# EAGLE design RFModule900_Mark1 (EAGLE 7.2.0)
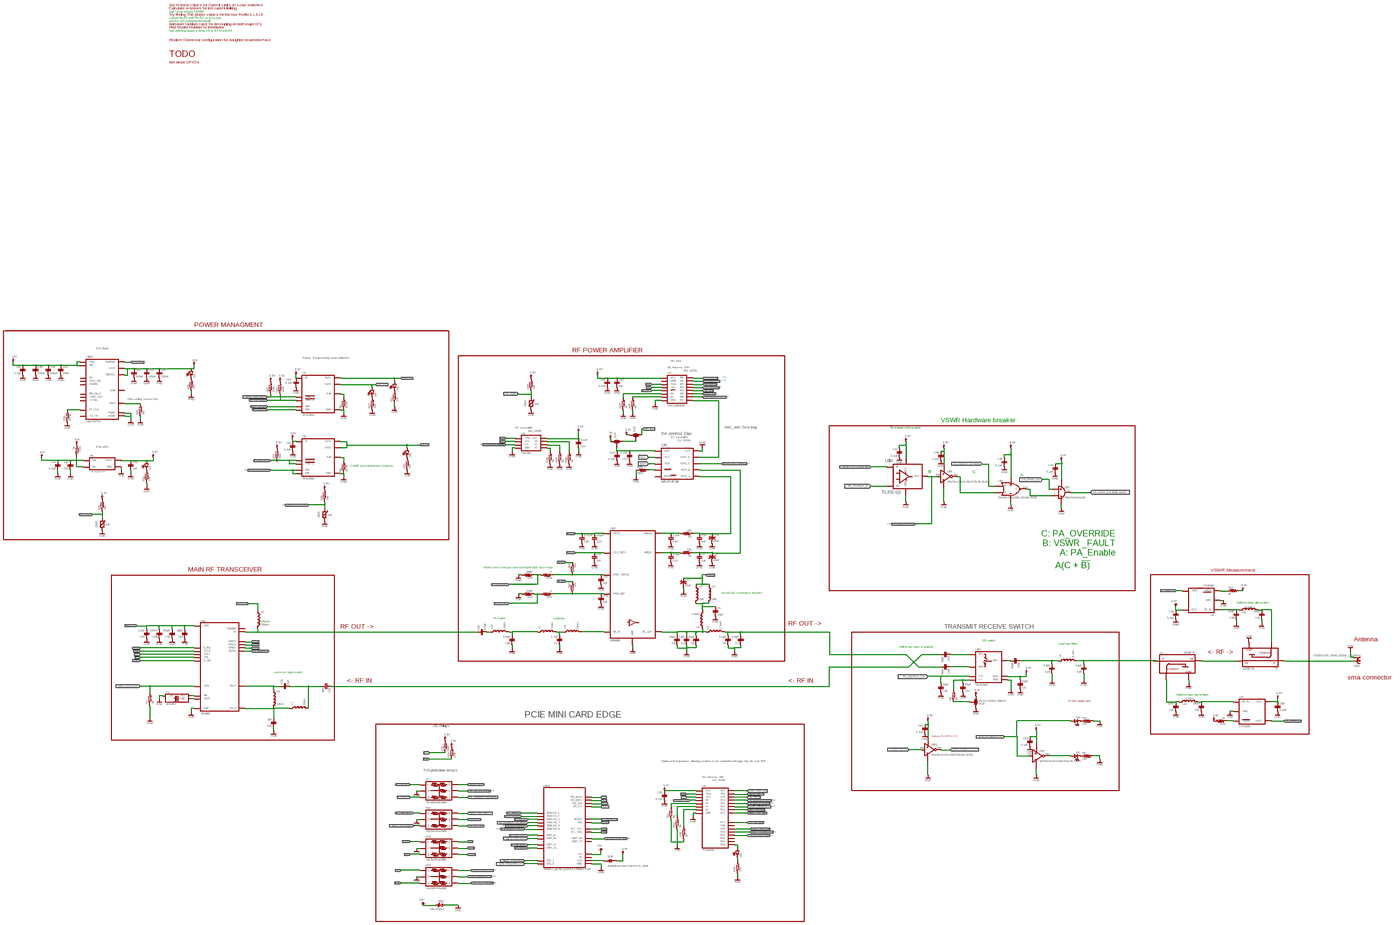
[diagram p0: schematic, sheet 1, overview]
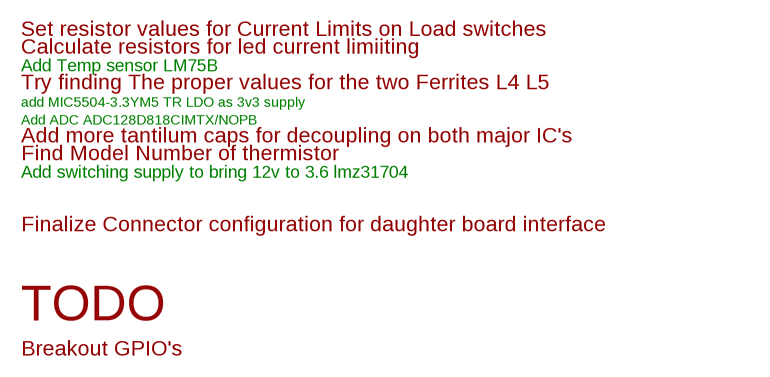
[diagram p1: schematic, sheet 1, part 1 of 4]
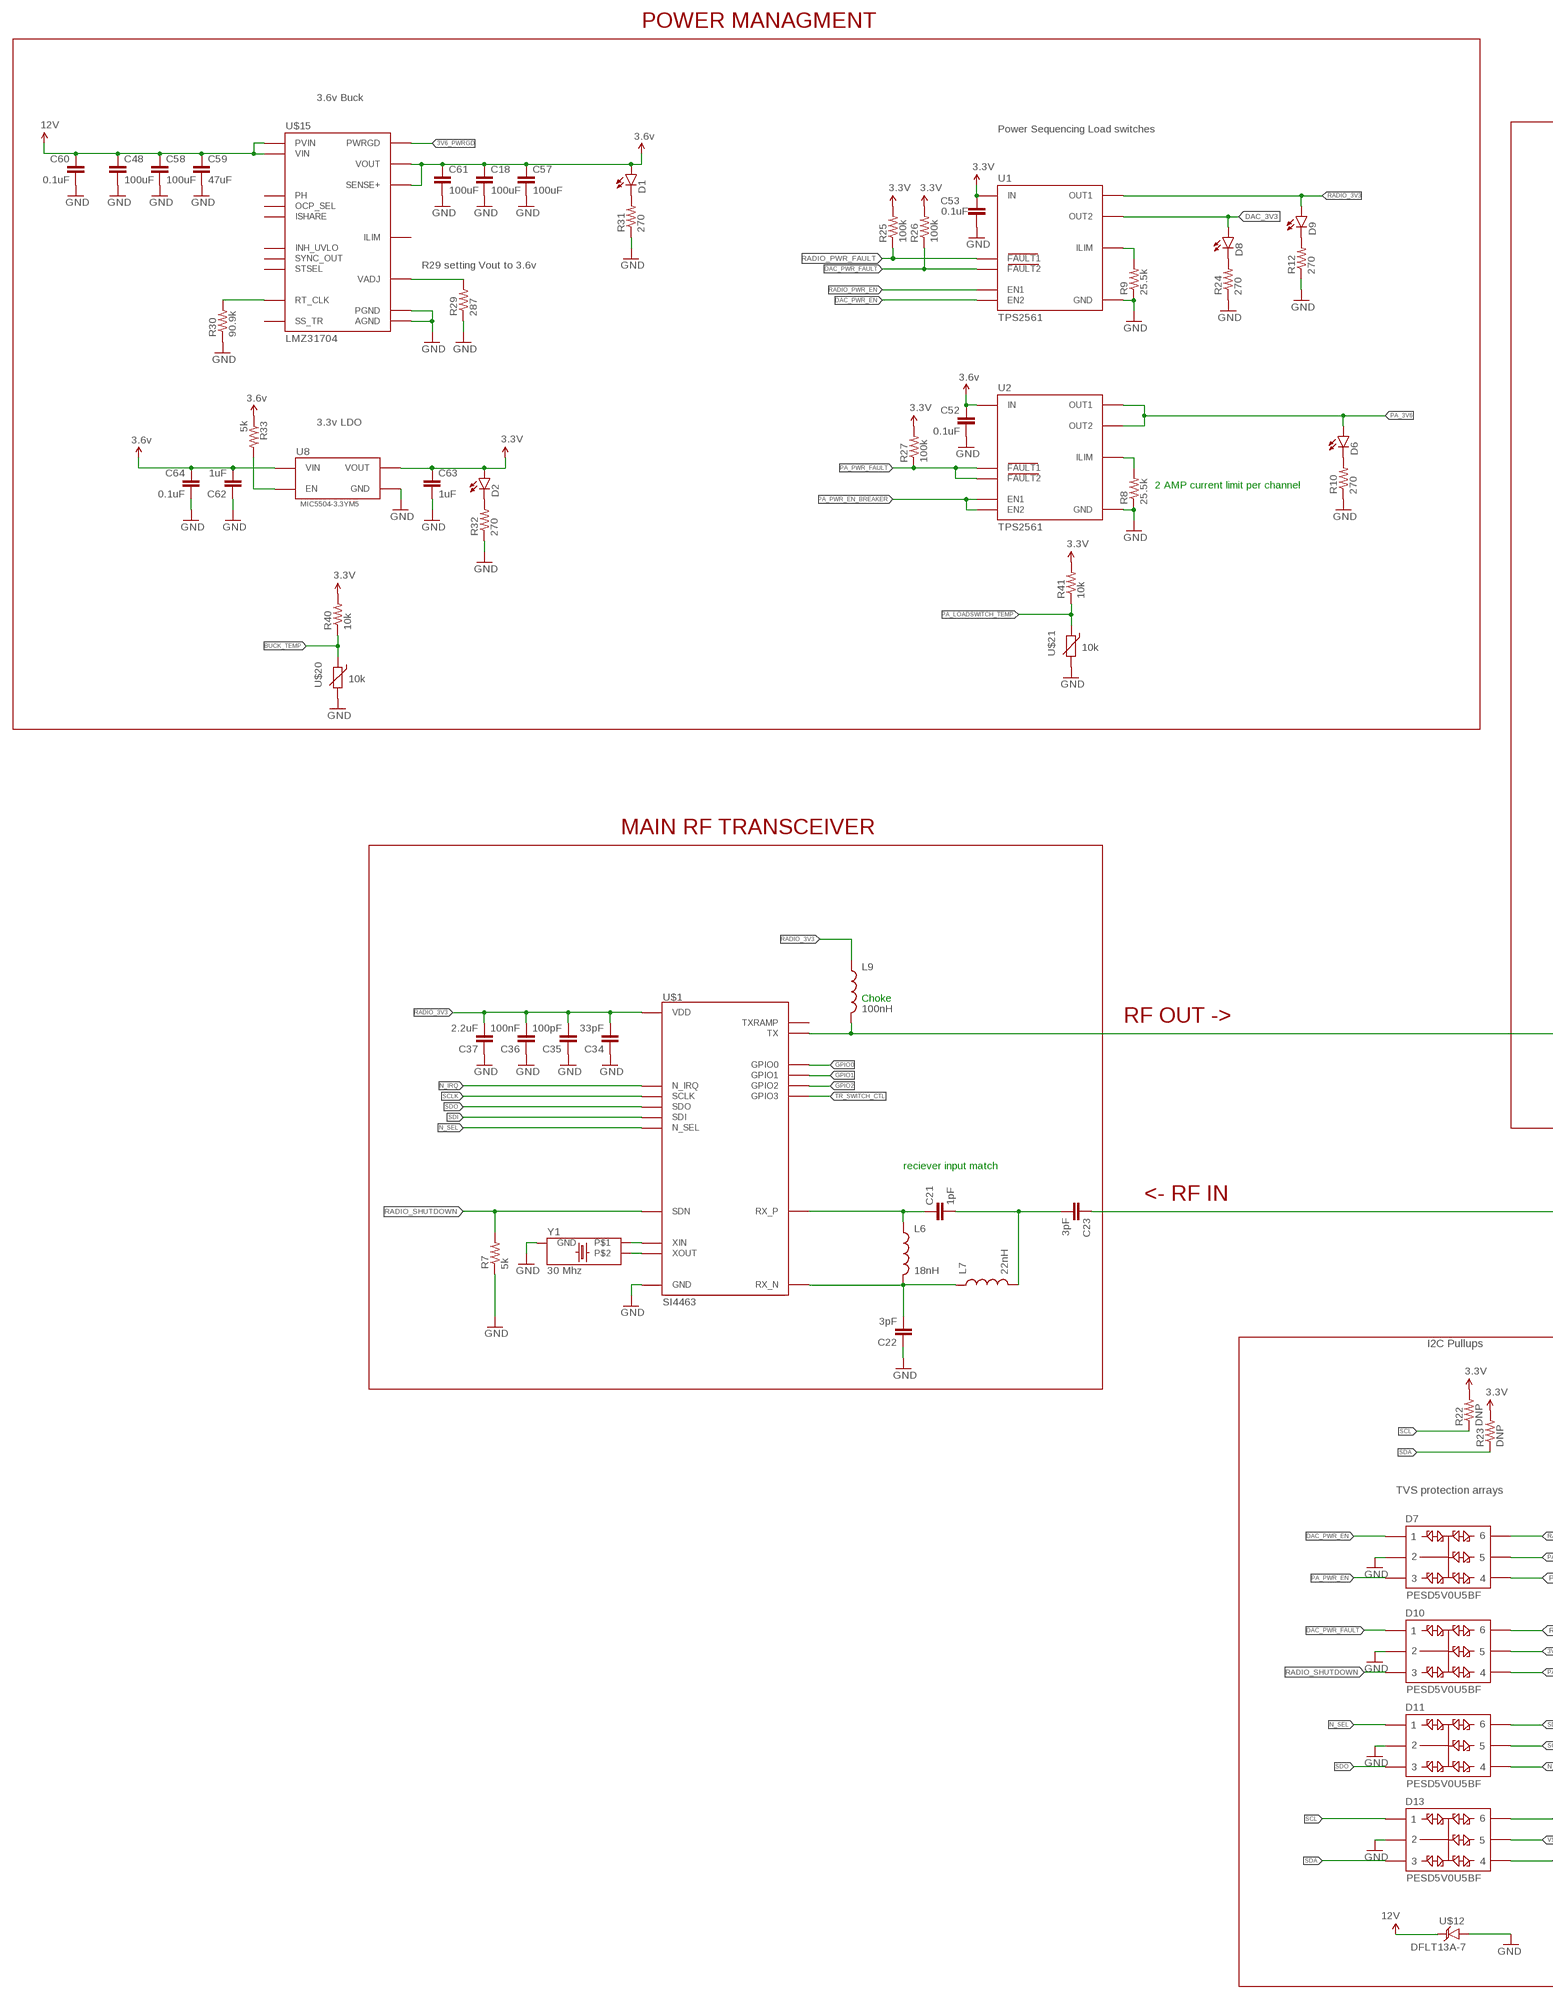
[diagram p2: schematic, sheet 1, part 2 of 4]
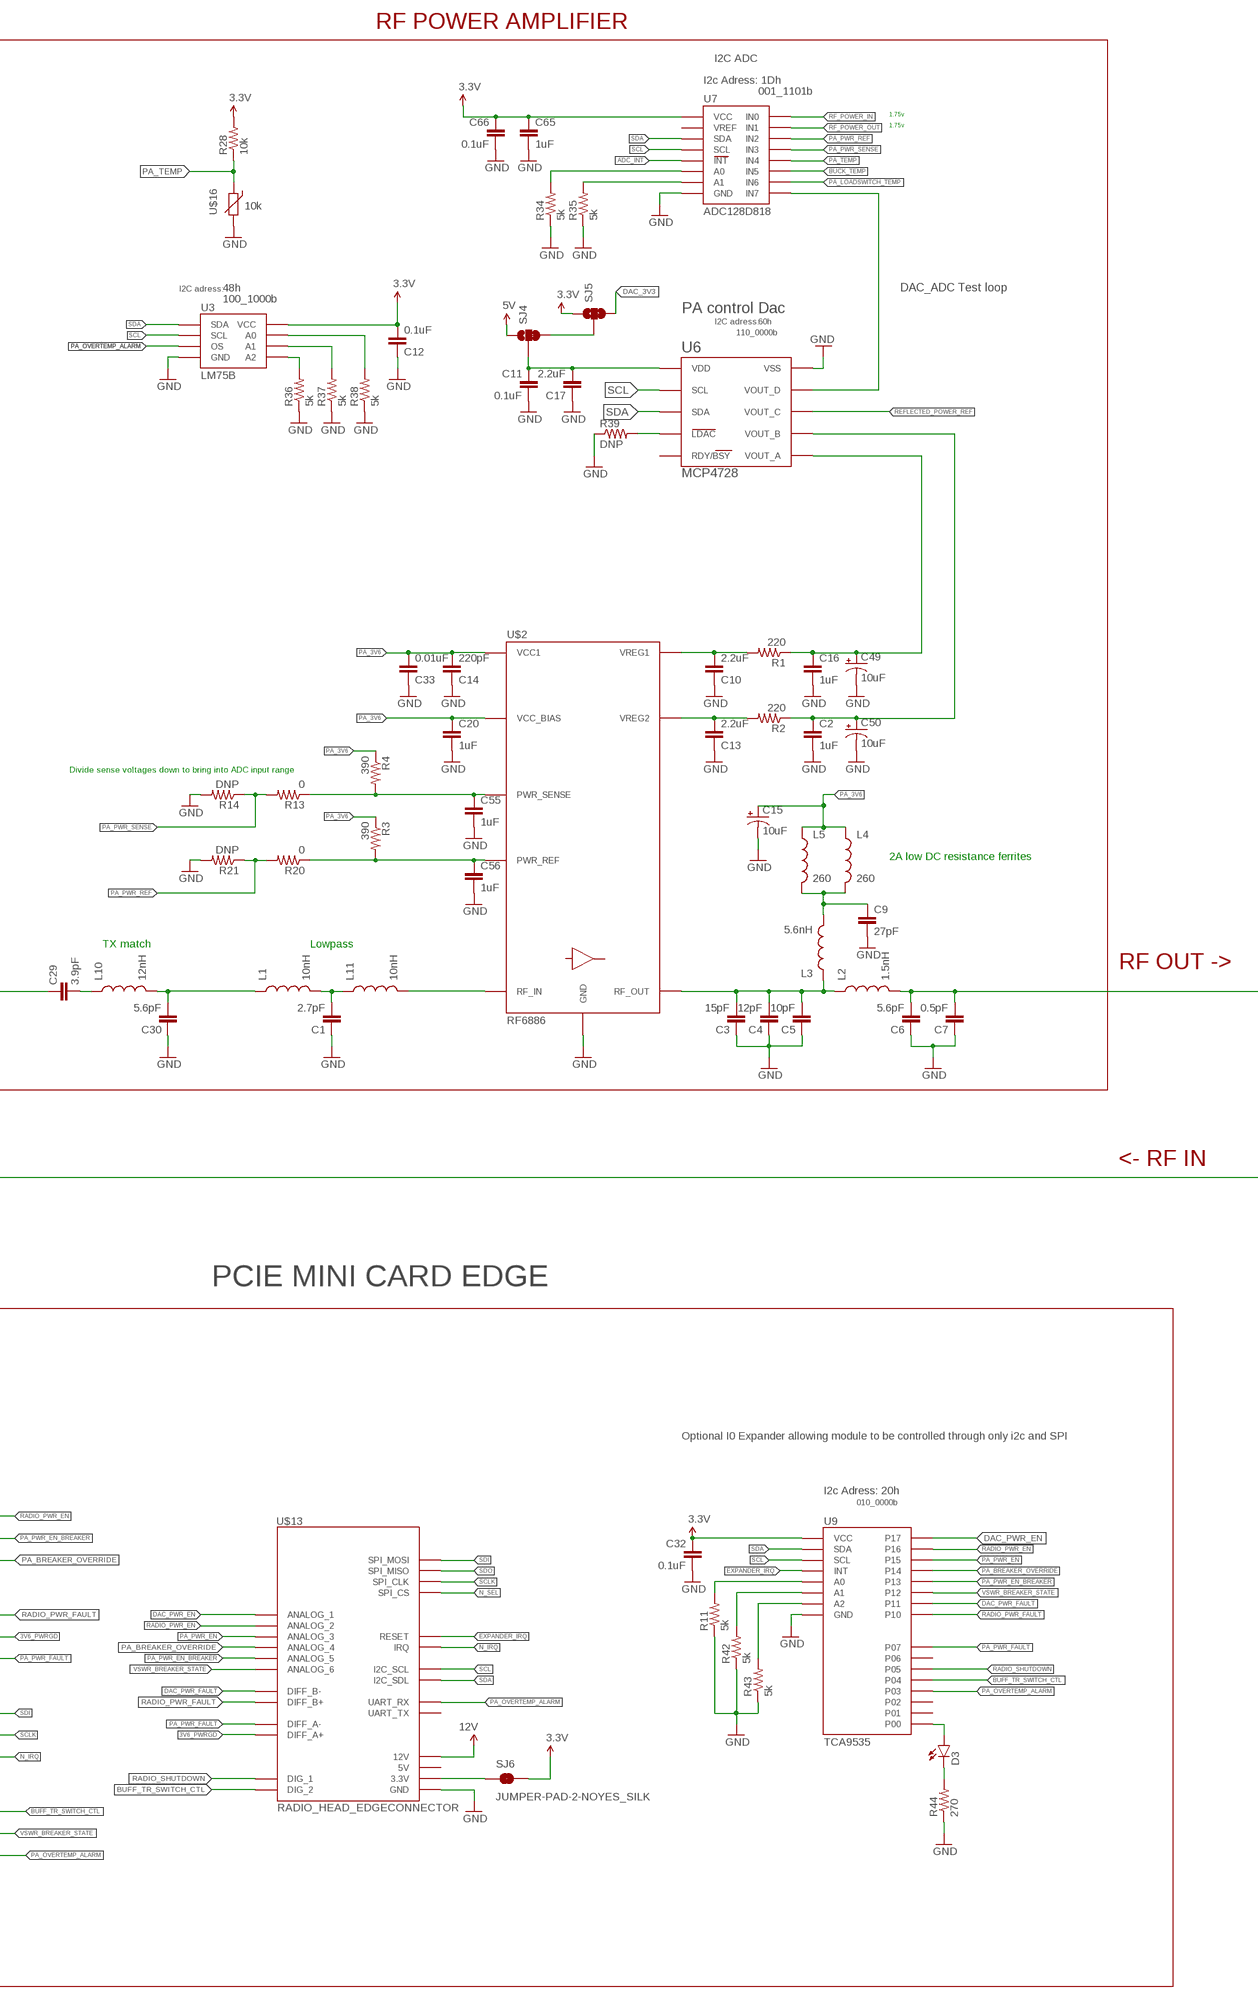
[diagram p3: schematic, sheet 1, part 3 of 4]
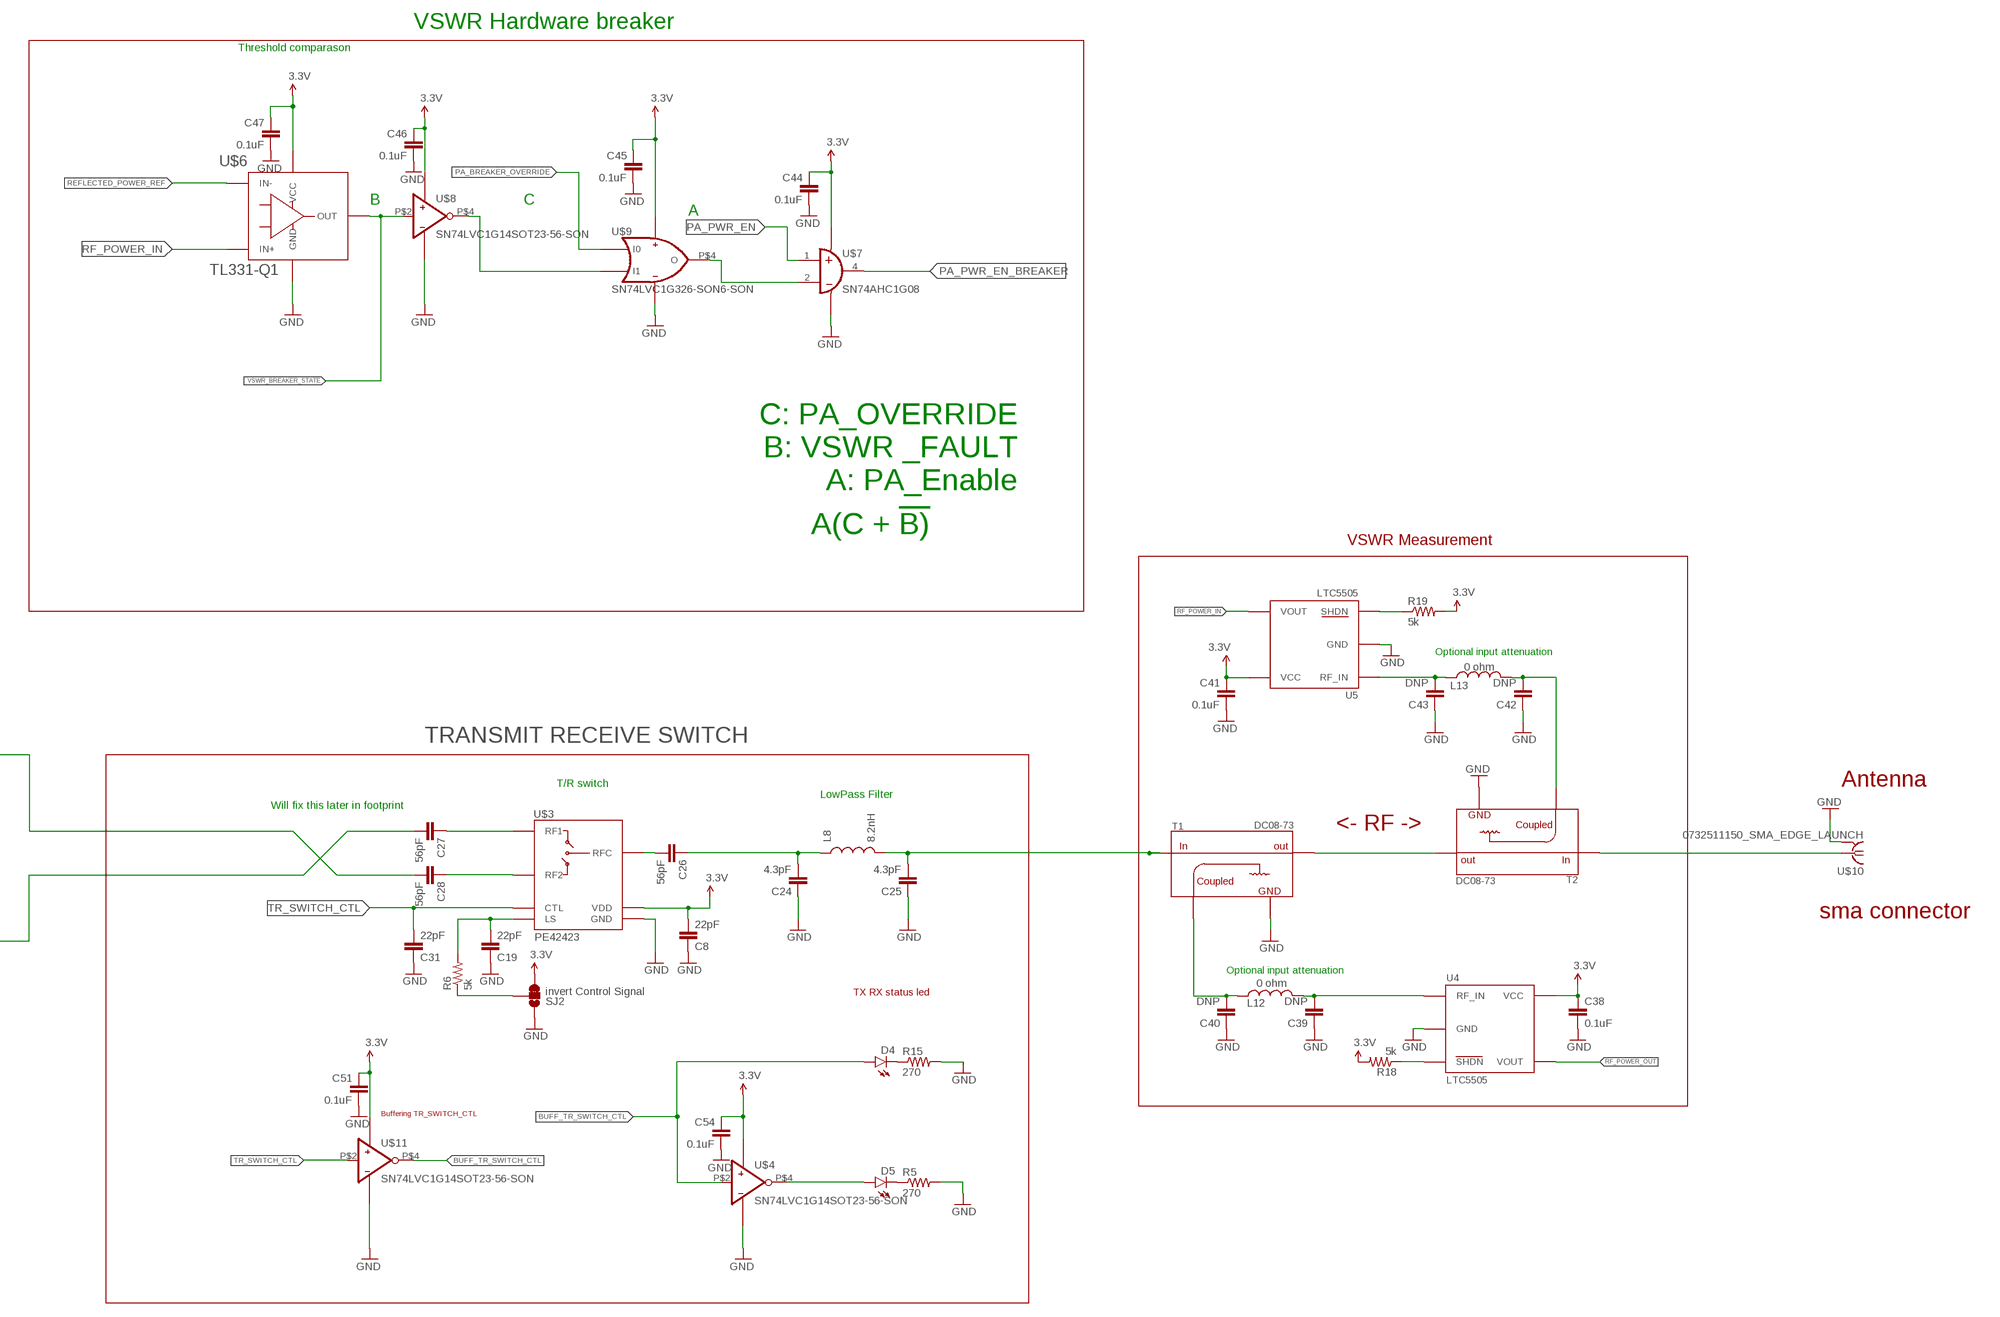
[diagram p4: schematic, sheet 1, part 4 of 4]

## Parts
C1  2.7pF  CAP0402-CAP  [0402-CAP]
C2  1uF  CAP0402-CAP  [0402-CAP]
C3  15pF  CAP0402-CAP  [0402-CAP]
C4  12pF  CAP0402-CAP  [0402-CAP]
C5  10pF  CAP0402-CAP  [0402-CAP]
C6  5.6pF  CAP0402-CAP  [0402-CAP]
C7  0.5pF  CAP0402-CAP  [0402-CAP]
C8  22pF  CAP0402-CAP  [0402-CAP]
C9  27pF  CAP0402-CAP  [0402-CAP]
C10  2.2uF  CAP0402-CAP  [0402-CAP]
C11  0.1uF  CAP0402-CAP  [0402-CAP]
C12  0.1uF  CAP0402-CAP  [0402-CAP]
C13  2.2uF  CAP0402-CAP  [0402-CAP]
C14  220pF  CAP0805  [0805]
C15  10uF  10UF-16V-10%(TANT)  [EIA3216]
C16  1uF  CAP0402-CAP  [0402-CAP]
C17  2.2uF  CAP0402-CAP  [0402-CAP]
C18  100uF  2.2UF-CERCAP-10009  [1206]
C19  22pF  CAP0402-CAP  [0402-CAP]
C20  1uF  CAP0402-CAP  [0402-CAP]
C21  1pF  CAP0402-CAP  [0402-CAP]
C22  3pF  CAP0402-CAP  [0402-CAP]
C23  3pF  CAP0402-CAP  [0402-CAP]
C24  4.3pF  CAP0402-CAP  [0402-CAP]
C25  4.3pF  CAP0402-CAP  [0402-CAP]
C26  56pF  CAP0402-CAP  [0402-CAP]
C27  56pF  CAP0402-CAP  [0402-CAP]
C28  56pF  CAP0402-CAP  [0402-CAP]
C29  3.9pF  CAP0402-CAP  [0402-CAP]
C30  5.6pF  CAP0402-CAP  [0402-CAP]
C31  22pF  CAP0402-CAP  [0402-CAP]
C32  0.1uF  CAP0402-CAP  [0402-CAP]
C33  0.01uF  CAP0402-CAP  [0402-CAP]
C34  33pF  CAP0402-CAP  [0402-CAP]
C35  100pF  CAP0402-CAP  [0402-CAP]
C36  100nF  CAP0402-CAP  [0402-CAP]
C37  2.2uF  CAP0402-CAP  [0402-CAP]
C38  0.1uF  CAP0402-CAP  [0402-CAP]
C39  DNP  CAP0402-CAP  [0402-CAP]
C40  DNP  CAP0402-CAP  [0402-CAP]
C41  0.1uF  CAP0402-CAP  [0402-CAP]
C42  DNP  CAP0402-CAP  [0402-CAP]
C43  DNP  CAP0402-CAP  [0402-CAP]
C44  0.1uF  CAP0402-CAP  [0402-CAP]
C45  0.1uF  CAP0402-CAP  [0402-CAP]
C46  0.1uF  CAP0402-CAP  [0402-CAP]
C47  0.1uF  CAP0402-CAP  [0402-CAP]
C48  100uF  C1210C107M4PAC7800  [CERAMIC_CAP_1210]
C49  10uF  10UF-16V-10%(TANT)  [EIA3216]
C50  10uF  10UF-16V-10%(TANT)  [EIA3216]
C51  0.1uF  CAP0402-CAP  [0402-CAP]
C52  0.1uF  CAP0402-CAP  [0402-CAP]
C53  0.1uF  CAP0402-CAP  [0402-CAP]
C54  0.1uF  CAP0402-CAP  [0402-CAP]
C55  1uF  CAP0402-CAP  [0402-CAP]
C56  1uF  CAP0402-CAP  [0402-CAP]
C57  100uF  2.2UF-CERCAP-10009  [1206]
C58  100uF  C1210C107M4PAC7800  [CERAMIC_CAP_1210]
C59  47uF  GRM32ER61C476KE15K  [CERAMIC_CAP_1210]
C60  0.1uF  CAP0402-CAP  [0402-CAP]
C61  100uF  2.2UF-CERCAP-10009  [1206]
C62  1uF  CAP0402-CAP  [0402-CAP]
C63  1uF  CAP0402-CAP  [0402-CAP]
C64  0.1uF  CAP0402-CAP  [0402-CAP]
C65  1uF  CAP0402-CAP  [0402-CAP]
C66  0.1uF  CAP0402-CAP  [0402-CAP]
D1  LED0603  [LED-0603]
D2  LED0603  [LED-0603]
D3  LED0603  [LED-0603]
D4  LED0603  [LED-0603]
D5  LED0603  [LED-0603]
D6  LED0603  [LED-0603]
D7  PESD5V0U5BF  [6-XFDFN]
D8  LED0603  [LED-0603]
D9  LED0603  [LED-0603]
D10  PESD5V0U5BF  [6-XFDFN]
D11  PESD5V0U5BF  [6-XFDFN]
D13  PESD5V0U5BF  [6-XFDFN]
L1  10nH  INDUCTOR0402  [C0402]
L2  1.5nH  INDUCTOR0603  [0603]
L3  5.6nH  INDUCTOR0402  [C0402]
L4  260  INDUCTOR0603  [0603]
L5  260  INDUCTOR0603  [0603]
L6  18nH  INDUCTOR0402  [C0402]
L7  22nH  INDUCTOR0402  [C0402]
L8  8.2nH  INDUCTOR0402  [C0402]
L9  100nH  INDUCTOR0402  [C0402]
L10  12nH  INDUCTOR0402  [C0402]
L11  10nH  INDUCTOR0402  [C0402]
L12  0 ohm  INDUCTOR0402  [C0402]
L13  0 ohm  INDUCTOR0402  [C0402]
R1  220  RESISTOR0402  [0402-RES]
R2  220  RESISTOR0402  [0402-RES]
R3  390  RESISTOR0402  [0402-RES]
R4  390  RESISTOR0402  [0402-RES]
R5  270  RESISTOR0402  [0402-RES]
R6  5k  RESISTOR0402  [0402-RES]
R7  5k  RESISTOR0402  [0402-RES]
R8  25.5k  RESISTOR0402  [0402-RES]
R9  25.5k  RESISTOR0402  [0402-RES]
R10  270  RESISTOR0402  [0402-RES]
R11  5k  RESISTOR0402  [0402-RES]
R12  270  RESISTOR0402  [0402-RES]
R13  0  RESISTOR0402  [0402-RES]
R14  DNP  RESISTOR0402  [0402-RES]
R15  270  RESISTOR0402  [0402-RES]
R18  5k  RESISTOR0402  [0402-RES]
R19  5k  RESISTOR0402  [0402-RES]
R20  0  RESISTOR0402  [0402-RES]
R21  DNP  RESISTOR0402  [0402-RES]
R22  DNP  RESISTOR0402  [0402-RES]
R23  DNP  RESISTOR0402  [0402-RES]
R24  270  RESISTOR0402  [0402-RES]
R25  100k  RESISTOR0402  [0402-RES]
R26  100k  RESISTOR0402  [0402-RES]
R27  100k  RESISTOR0402  [0402-RES]
R28  10k  RESISTOR0402  [0402-RES]
R29  287  RESISTOR0402  [0402-RES]
R30  90.9k  RESISTOR0402  [0402-RES]
R31  270  RESISTOR0402  [0402-RES]
R32  270  RESISTOR0402  [0402-RES]
R33  5k  RESISTOR0402  [0402-RES]
R34  5k  RESISTOR0402  [0402-RES]
R35  5k  RESISTOR0402  [0402-RES]
R36  5k  RESISTOR0402  [0402-RES]
R37  5k  RESISTOR0402  [0402-RES]
R38  5k  RESISTOR0402  [0402-RES]
R39  DNP  RESISTOR0402  [0402-RES]
R40  10k  RESISTOR0402  [0402-RES]
R41  10k  RESISTOR0402  [0402-RES]
R42  5k  RESISTOR0402  [0402-RES]
R43  5k  RESISTOR0402  [0402-RES]
R44  270  RESISTOR0402  [0402-RES]
SJ2  invert Control Signal  JUMPER-PAD-3-2OF3_NC_BY_TRACE_SMALL  [PAD-JUMPER-3-2OF3_NC_BY_TRACE_YES_SILK_FULL_BOX]
SJ4  JUMPER-PAD-3-2OF3_NC_BY_TRACE_SMALL  [PAD-JUMPER-3-2OF3_NC_BY_TRACE_YES_SILK_FULL_BOX]
SJ5  JUMPER-PAD-3-2OF3_NC_BY_TRACE_SMALL  [PAD-JUMPER-3-2OF3_NC_BY_TRACE_YES_SILK_FULL_BOX]
SJ6  JUMPER-PAD-2-NOYES_SILK  [PAD-JUMPER-2-NO_YES_SILK]
T1  DC08-73  [SOT23-6]
T2  DC08-73  [SOT23-6]
U1  TPS2561  [10-VFDFN]
U2  TPS2561  [10-VFDFN]
U3  LM75B  [HWSON8]
U4  LTC5505  [TSOT-23-5]
U5  LTC5505  [TSOT-23-5]
U6  MCP4728  [10-MSOP]
U7  ADC128D818  [16-TSSOP]
U8  MIC5504-3.3YM5  [SOT23-5]
U9  TCA9535  [24-WQFN]
U$1  SI4463  [20-VFQFN]
U$2  RF6886  [24-VFQFN]
U$3  PE42423  [16-QFN]
U$4  SN74LVC1G14SOT23-56-SON  [6-SON]
U$6  TL331-Q1  [SOT23-5]
U$7  SN74AHC1G08  [SOT23-5]
U$8  SN74LVC1G14SOT23-56-SON  [6-SON]
U$9  SN74LVC1G326-SON6-SON  [6-SON]
U$10  0732511150_SMA_EDGE_LAUNCH  [SMA_EDGE_LAUNCH]
U$11  SN74LVC1G14SOT23-56-SON  [6-SON]
U$12  DFLT13A-7  [POWERDI®123]
U$13  RADIO_HEAD_EDGECONNECTOR  [PCIE_MINI_CARDEDGE]
U$15  LMZ31704  [42-QFN]
U$16  10k  THERMISTOR  [0402]
U$20  10k  THERMISTOR  [0402]
U$21  10k  THERMISTOR  [0402]
Y1  30 Mhz  CRYSTAL  [4-SMD_3.2_X_2.5]

## Nets
3.3V: C8.2 C12.2 C32.1 C38.1 C41.1 C44.1 C45.1 C46.1 C47.1 C51.1 C53.1 C54.1 C63.1 C65.1 C66.1 D2.A R18.2 R19.2 R22.2 R23.2 R25.2 R26.2 R27.2 R28.2 R40.2 R41.2 SJ2.3 SJ5.1 SJ6.2 U1.P$2(IN) U1.P$3(IN) U3.P$8(VCC) U4.P$5(VCC) U5.P$5(VCC) U7.5(VCC) U8.5(VOUT) U9.P$21(VCC) U$3.P$16(VDD) U$4.P$6(VCC) U$6.5(VCC) U$7.5(VCC) U$8.P$6(VCC) U$9.P$6(VCC) U$11.P$6(VCC)
3.6V: C18.1 C52.1 C57.1 C61.1 C62.2 C64.1 D1.A R33.1 U2.P$2(IN) U2.P$3(IN) U8.1(VIN) U$15.P$27(SENSE+) U$15.P$34(VOUT) U$15.P$35(VOUT) U$15.P$36(VOUT) U$15.P$37(VOUT) U$15.P$38(VOUT) U$15.P$41(VOUT)
3V6_PWRGD: D10.P$5 U$13.P$18(DIFF_A+) U$15.P$8(PWRGD)
5V: SJ4.1
12V: C48.P$1 C58.P$1 C59.P$1 C60.1 U$12.CATHODE U$13.P$45(12V) U$13.P$47(12V) U$13.P$49(12V) U$13.P$51(12V) U$15.P$1(PVIN) U$15.P$3(VIN) U$15.P$11(PVIN) U$15.P$12(PVIN) U$15.P$39(PVIN) U$15.P$40(PVIN)
ADC_INT: U7.6(INT)
BUCK_TEMP: R40.1 U7.11(IN5) U$20.1
BUFF_TR_SWITCH_CTL: D4.A D13.P$6 U9.P$5(P04) U$4.P$2(I) U$11.P$4(O) U$13.P$25(DIG_2)
DAC_3V3: D8.A SJ5.3 U1.P$8(OUT2)
DAC_PWR_EN: D7.P$1 U1.P$5(EN2) U9.P$17(P17) U$13.P$10(ANALOG_1)
DAC_PWR_FAULT: D10.P$1 R26.1 U1.P$6(FAULT2) U9.P$11(P11) U$13.P$24(DIFF_B-)
EXPANDER_IRQ: U9.P$22(INT) U$13.P$9(RESET)
GND: C1.1 C2.2 C3.1 C4.1 C5.1 C6.1 C7.1 C8.1 C9.2 C10.1 C11.2 C12.1 C13.1 C14.1 C15.C(-) C16.2 C17.1 C18.2 C19.1 C20.2 C22.1 C24.1 C25.1 C30.1 C31.1 C32.2 C33.1 C34.1 C35.1 C36.1 C37.1 C38.2 C39.1 C40.1 C41.2 C42.1 C43.1 C44.2 C45.2 C46.2 C47.2 C48.P$2 C49.C(-) C50.C(-) C51.2 C52.2 C53.2 C54.2 C55.2 C56.2 C57.2 C58.P$2 C59.P$2 C60.2 C61.2 C62.1 C63.2 C64.2 C65.2 C66.2 D7.P$2 D10.P$2 D11.P$2 D13.P$2 R5.2 R7.1 R8.1 R9.1 R10.1 R11.1 R12.1 R14.2 R15.2 R21.2 R24.1 R29.1 R30.1 R31.1 R32.1 R34.1 R35.1 R36.1 R37.1 R38.1 R39.1 R42.1 R43.1 R44.1 SJ2.1 T1.1(GND) T1.2(GND) T1.5(GND) T2.1(GND) T2.2(GND) T2.5(GND) U1.GNDPAD(GND) U1.P$1(GND) U2.GNDPAD(GND) U2.P$1(GND) U3.P$4(GND) U4.P$2(GND) U5.P$2(GND) U6.P$10(VSS) U7.4(GND) U8.2(GND) U9.GND_PAD(GND) U9.P$9(GND) U$1.GND_PAD(GND) U$1.P$18(GND) U$2.P$GND_PAD(GND) U$3.P$1(GND) U$3.P$3(GND) U$3.P$4(GND) U$3.P$5(GND) U$3.P$6(GND) U$3.P$8(GND) U$3.P$9(GND) U$3.P$10(GND) U$3.P$12(GND) U$3.P$13(GND) U$3.P$GNDPAD(GND) U$4.P$3(GND) U$6.2(GND) U$7.3(GND) U$8.P$3(GND) U$9.P$3(GND) U$10.GND@1(GND) U$10.GND@2(GND) U$10.GND@3(GND) U$10.GND@5(GND) U$11.P$3(GND) U$12.ANODE U$13.P$3(GND) U$13.P$4(GND) U$13.P$7(GND) U$13.P$8(GND) U$13.P$11(GND) U$13.P$12(GND) U$13.P$15(GND) U$13.P$16(GND) U$13.P$22(GND) U$13.P$27(GND) U$13.P$28(GND) U$13.P$30(GND) U$13.P$34(GND) U$13.P$38(GND) U$13.P$42(GND) U$13.P$44(GND) U$13.P$46(GND) U$13.P$48(GND) U$15.P$2(AGND) U$15.P$20(PGND) U$15.P$21(PGND) U$15.P$23(AGND) U$15.P$31(PGND) U$15.P$32(PGND) U$15.P$33(PGND) U$16.2 U$20.2 U$21.2 Y1.P$2(GND) Y1.P$4(GND)
GPIO0: U$1.P$9(GPIO0)
GPIO1: U$1.P$10(GPIO1)
GPIO2: U$1.P$19(GPIO2)
N$1: C1.2 L1.2 L11.1
N$2: C10.2 R1.2 U$2.P$19(VREG1)
N$3: U$8.P$4(O) U$9.P$2(I1)
N$4: D3.C R44.2
N$5 [RF Path]: C6.2 C7.2 C28.2 L2.2
N$6: C9.1 L3.2 L4.2 L5.2
N$7: SJ6.1 U$13.P$29(3.3V) U$13.P$31(3.3V) U$13.P$33(3.3V) U$13.P$35(3.3V) U$13.P$37(3.3V) U$13.P$39(3.3V)
N$8 [RF Path]: C3.2 C4.2 C5.2 L2.1 L3.1 U$2.P$13(RF_OUT) U$2.P$14(RF_OUT) U$2.P$15(RF_OUT) U$2.P$16(RF_OUT) U$2.P$17(RF_OUT) U$2.P$18(RF_OUT)
N$9: C13.2 R2.2 U$2.P$5(VREG2)
N$10 [RF Path]: C24.2 C26.1 L8.1
N$11: R9.2 U1.P$7(ILIM)
N$12 [RF Path]: C21.1 L6.1 U$1.P$2(RX_P)
N$13 [RF Path]: C21.2 C23.2 L7.2
N$14 [RF Path]: C23.1 C27.2
N$15 [RF Path]: C25.2 L8.2 T1.4(IN)
N$16: C26.2 U$3.P$7(RFC)
N$17 [RF Path]: L11.2 U$2.P$6(RF_IN)
N$18: U6.P$9(VOUT_D) U7.9(IN7)
N$19: U$7.2(I1) U$9.P$4(O)
N$20 [RF Path]: C29.1 L9.2 U$1.P$4(TX)
N$21: C29.2 L10.1
N$22 [RF Path]: C30.2 L1.1 L10.2
N$23 [RF Path]: C27.1 U$3.P$2(RF1)
N$24 [RF Path]: C28.1 U$3.P$11(RF2)
N$25: R6.1 SJ2.2
N$26: C19.2 R6.2 U$3.P$15(LS)
N$27 [RF Path]: C22.2 L6.2 L7.1 U$1.P$3(RX_N)
N$28: U$1.P$17(XIN) Y1.P$1
N$29: U$1.P$16(XOUT) Y1.P$3
N$30: D6.C R10.2
N$31: D8.C R24.2
N$32: R8.2 U2.P$7(ILIM)
N$33: D5.C R5.1
N$34: D5.A U$4.P$4(O)
N$36: D4.C R15.1
N$37: R18.1 U4.P$3(SHDN)
N$39 [RF Path]: C40.2 L12.1 T1.3(COUPLED)
N$40 [RF Path]: C39.2 L12.2 U4.P$1(RF_IN)
N$41 [RF Path]: T1.6(OUT) T2.6(OUT)
N$42: R19.1 U5.P$3(SHDN)
N$43 [RF Path]: C43.2 L13.1 U5.P$1(RF_IN)
N$44 [RF Path]: C42.2 L13.2 T2.3(COUPLED)
N$45 [RF Path]: T2.4(IN) U$10.P
N$47: C55.1 R4.2 R13.1 U$2.P$23(PWR_SENSE)
N$48: C56.1 R3.2 R20.1 U$2.P$24(PWR_REF)
N$49: C11.1 C17.2 SJ4.2 U6.P$1(VDD)
N$50: D9.C R12.2
N$53: SJ4.3 SJ5.2
N$54: R29.2 U$15.P$26(VADJ)
N$55: R30.2 U$15.P$22(RT_CLK)
N$56: D2.C R32.2
N$57: R33.2 U8.3(EN)
N$58: D1.C R31.2
N$59: R35.2 U7.8(A1)
N$60: R34.2 U7.7(A0)
N$61: R36.2 U3.P$5(A2)
N$62: R37.2 U3.P$6(A1)
N$63: R38.2 U3.P$7(A0)
N$64: R39.2 U6.P$4(LDAC)
N$65: D3.A U9.P$1(P00)
N$66: R11.2 U9.P$18(A0)
N$67: R42.2 U9.P$23(A1)
N$68: R43.2 U9.P$24(A2)
N_IRQ: D11.P$4 U$1.P$11(N_IRQ) U$13.P$32(IRQ)
N_SEL: D11.P$1 U$1.P$15(N_SEL) U$13.P$6(SPI_CS)
PA_3V6: C14.2 C15.A(+) C20.1 C33.2 D6.A L4.1 L5.1 R3.1 R4.1 U2.P$8(OUT2) U2.P$9(OUT1) U$2.P$1(VCC1) U$2.P$2(VCC1) U$2.P$3(VCC1) U$2.P$22(VCC_BIAS)
PA_BREAKER_OVERRIDE: D7.P$4 U9.P$14(P14) U$9.P$1(I0) U$13.P$17(ANALOG_4)
PA_LOADSWITCH_TEMP: R41.1 U7.10(IN6) U$21.1
PA_OVERTEMP_ALARM: D13.P$4 U3.P$3(OS) U9.P$4(P03) U$13.P$52(UART_RX)
PA_PWR_EN: D7.P$3 U9.P$15(P15) U$7.1(I0) U$13.P$14(ANALOG_3)
PA_PWR_EN_BREAKER: D7.P$5 U2.P$4(EN1) U2.P$5(EN2) U9.P$13(P13) U$7.4(O) U$13.P$19(ANALOG_5)
PA_PWR_FAULT: D10.P$4 R27.1 U2.P$6(FAULT2) U2.P$10(FAULT1) U9.P$8(P07) U$13.P$20(DIFF_A-)
PA_PWR_REF: R20.2 R21.1 U7.14(IN2)
PA_PWR_SENSE: R13.2 R14.1 U7.13(IN3)
PA_TEMP: R28.1 U7.12(IN4) U$16.1
RADIO_3V3: C34.2 C35.2 C36.2 C37.2 D9.A L9.1 U1.P$9(OUT1) U$1.P$6(VDD) U$1.P$8(VDD)
RADIO_PWR_EN: D7.P$6 U1.P$4(EN1) U9.P$16(P16) U$13.P$13(ANALOG_2)
RADIO_PWR_FAULT: D10.P$6 R25.1 U1.P$10(FAULT1) U9.P$10(P10) U$13.P$26(DIFF_B+)
RADIO_SHUTDOWN: D10.P$3 R7.2 U9.P$6(P05) U$1.P$1(SDN) U$13.P$23(DIG_1)
REFLECTED_POWER_REF: U6.P$8(VOUT_C) U$6.1(IN-)
RF_POWER_IN: U5.P$4(VOUT) U7.16(IN0) U$6.3(IN+)
RF_POWER_OUT: U4.P$4(VOUT) U7.15(IN1)
SCL: D13.P$1 R22.1 U3.P$2(SCL) U6.P$2(SCL) U7.3(SCL) U9.P$19(SCL) U$13.P$40(I2C_SCL)
SCLK: D11.P$5 U$1.P$12(SCLK) U$13.P$2(SPI_CLK)
SDA: D13.P$3 R23.1 U3.P$1(SDA) U6.P$3(SDA) U7.2(SDA) U9.P$20(SDA) U$13.P$36(I2C_SDL)
SDI: D11.P$6 U$1.P$14(SDI) U$13.P$1(SPI_MOSI)
SDO: D11.P$3 U$1.P$13(SDO) U$13.P$5(SPI_MISO)
TR_SWITCH_CTL: C31.2 U$1.P$20(GPIO3) U$3.P$14(CTL) U$11.P$2(I)
VREG1_DAC: C16.1 C49.A(+) R1.1 U6.P$6(VOUT_A)
VREG2_DAC: C2.1 C50.A(+) R2.1 U6.P$7(VOUT_B)
VSWR_BREAKER_STATE: D13.P$5 U9.P$12(P12) U$6.4(OUT) U$8.P$2(I) U$13.P$21(ANALOG_6)
Unconnected: U6.P$5(RDY/BSY) U7.1(VREF) U9.P$2(P01) U9.P$3(P02) U9.P$7(P06) U$1.P$7(TXRAMP) U$13.P$41(5V) U$13.P$43(5V) U$13.P$50(UART_TX) U$15.P$4(OCP_SEL) U$15.P$6(ILIM) U$15.P$7(SYNC_OUT) U$15.P$10(PH) U$15.P$13(PH) U$15.P$14(PH) U$15.P$15(PH) U$15.P$16(PH) U$15.P$17(PH) U$15.P$18(PH) U$15.P$19(PH) U$15.P$25(ISHARE) U$15.P$28(SS_TR) U$15.P$29(STSEL) U$15.P$30(INH_UVLO) U$15.P$42(PH) U$15.P$42L(PH)

## Notes on the sheet
- Set resistor values for Current Limits on Load switches
- Calculate resistors for led current limiiting
- Add Temp sensor LM75B
- Try finding The proper values for the two Ferrites L4 L5
- add MIC5504-3.3YM5 TR LDO as 3v3 supply
- Add ADC ADC128D818CIMTX/NOPB
- Add more tantilum caps for decoupling on both major IC's
- Find Model Number of thermistor
- Add switching supply to bring 12v to 3.6 lmz31704
- Finalize Connector configuration for daughter board interface
- TODO
- Breakout GPIO's
- POWER MANAGMENT
- 3.6v Buck
- RF POWER AMPLIFIER
- Power Sequencing Load switches
- I2C ADC
- I2c Adress: 1Dh
- 001_1101b
- 1.75v
- 1.75v
- R29 setting Vout to 3.6v
- VSWR Hardware breaker
- I2C adress: | 48h | DAC_ADC Test loop | Threshold comparason
- 100_1000b
- PA control Dac
- I2C adress: | 60h
- 110_0000b
- 3.3v LDO
- 2 AMP current limit per channel
- B | C
- A
- C: PA_OVERRIDE
- B: VSWR _FAULT
- A: PA_Enable
- A(C + !B)
- Divide sense voltages down to bring into ADC input range
- MAIN RF TRANSCEIVER | VSWR Measurement
- 2A low DC resistance ferrites
- Optional input attenuation
- TX match | Lowpass
- Choke
- RF OUT ->
- RF OUT -> | TRANSMIT RECEIVE SWITCH
- T/R switch | Antenna
- LowPass Filter
- Will fix this later in footprint
- <- RF ->
- reciever input match
- sma connector
- <- RF IN | <- RF IN
- Optional input attenuation
- TX RX status led
- PCIE MINI CARD EDGE
- I2C Pullups
- Buffering TR_SWITCH_CTL
- Optional I0 Expander allowing module to be controlled through only i2c and SPI
- TVS protection arrays
- I2c Adress: 20h
- 010_0000b

## Library data of the parts
C1 C8 C10-C13 C17 C19 C21-C31 C33-C47 C51-C54 = SparkFun-Capacitors:CAP: Capacitor Standard 0603 ceramic capacitor, and 0.1" leaded capacitor.
C2 C16 = SparkFun-Capacitors:CAP: Capacitor Standard 0603 ceramic capacitor, and 0.1" leaded capacitor.; DIGI: 587-1453-1-ND; MPN: JMK105BJ225MVHF
C3 = SparkFun-Capacitors:CAP: Capacitor Standard 0603 ceramic capacitor, and 0.1" leaded capacitor.; DIGI: 712-1261-1-ND; MPN: 500R07S150JV4TD
C4 = SparkFun-Capacitors:CAP: Capacitor Standard 0603 ceramic capacitor, and 0.1" leaded capacitor.; DIGI: 712-1257-1-ND; MPN: 500R07S120JV4TD
C5 = SparkFun-Capacitors:CAP: Capacitor Standard 0603 ceramic capacitor, and 0.1" leaded capacitor.; DIGI: 712-1253-1-ND; MPN: 500R07S100JV4TD
C6 = SparkFun-Capacitors:CAP: Capacitor Standard 0603 ceramic capacitor, and 0.1" leaded capacitor.; MOUSER: 609-500R07S5R6BV4T; MPN: 500R07S5R6BV4
C7 = SparkFun-Capacitors:CAP: Capacitor Standard 0603 ceramic capacitor, and 0.1" leaded capacitor.; DIGI: 712-1162-1-ND; MPN: 500R07S0R5BV4TD
C9 = SparkFun-Capacitors:CAP: Capacitor Standard 0603 ceramic capacitor, and 0.1" leaded capacitor.; DIGI: 712-1277-1-ND
C14 = SparkFun-Capacitors:CAP: Capacitor Standard 0603 ceramic capacitor, and 0.1" leaded capacitor.; DIGI: 712-1398-1-ND
C15 C49 C50 = SparkFun-Capacitors:10UF-16V-10%(TANT): CAP-00811 1206/EIA-3216 Tantalum capacitor; DIGI: 399-3678-1-ND; MPN: T491A105K016AT; PROD_ID: CAP-00811
C18 C57 C61 = SparkFun-Retired:2.2UF-CER: 2.2uF Ceramic SMT CAP-07888- 10V, 20% (0603) CAP-10009- 50V, 10% (1206); DIGI: 490-7217-2-ND; MPN: GRM31CR60J107ME39K; VALUE: 2.2uF
C20 C55 C56 C62 C63 C65 = SparkFun-Capacitors:CAP: Capacitor Standard 0603 ceramic capacitor, and 0.1" leaded capacitor.; DIGI: 490-3890-1-ND; MPN: GRM155R61A105KE15D
C32 C60 C64 C66 = SparkFun-Capacitors:CAP: Capacitor Standard 0603 ceramic capacitor, and 0.1" leaded capacitor.; DIGI: 311-1338-1-ND; MPN: CC0402KRX7R7BB104
C48 C58 = RitLaunchInitiative:C1210C107M4PAC7800: CAP CER 100UF 16V X5R 1210 | 1210 MLCC; DIGI: 399-11270-1-ND; MPN: C1210C107M4PAC7800
C59 = RitLaunchInitiative:GRM32ER61C476KE15K: CAP CER 47UF 16V X5R 1210; DIGI: 490-6538-1-ND; MPN: GRM32ER61C476KE15K
D1-D3 D6 D8 D9 = SparkFun-LED:LED: LEDs Standard schematic elements and footprints for 5mm, 3mm, 1206, and 0603 sized LEDs. 5mm - Spark Fun Electronics SKU : COM-00529 (and others); COLOR: Red; DIGI: 160-1447-1-ND
D4 = SparkFun-LED:LED: LEDs Standard schematic elements and footprints for 5mm, 3mm, 1206, and 0603 sized LEDs. 5mm - Spark Fun Electronics SKU : COM-00529 (and others); COLOR: Green; DIGI: 160-1446-1-ND
D5 = SparkFun-LED:LED: LEDs Standard schematic elements and footprints for 5mm, 3mm, 1206, and 0603 sized LEDs. 5mm - Spark Fun Electronics SKU : COM-00529 (and others); COLOR: Blue; DIGI: 160-1647-1-ND
D7 D10 D11 D13 = RitLaunchInitiative:PESD5V0U5BF: TVS Diode array| TVS DIODE 5VWM | 5 channels bi-directional; DIGI: 568-7355-1-ND; MPN: PESD5V0U5BF
L1 L6-L13 = SparkFun-Passives:INDUCTOR: Inductors Basic Inductor/Choke - 0603 and 1206. Footprints are not proven and vary greatly between part numbers. INDUCTOR POWER 3.3UH 4.0A SMD 0.197" L x 0.197" W x 0.177" H (5.00mm x 5.00mm x 4.50mm)
L2 = SparkFun-Passives:INDUCTOR: Inductors Basic Inductor/Choke - 0603 and 1206. Footprints are not proven and vary greatly between part numbers. INDUCTOR POWER 3.3UH 4.0A SMD 0.197" L x 0.197" W x 0.177" H (5.00mm x 5.00mm x 4.50mm); MPN: LL1608-FSL1N5S; RICHARDSON_RFPD: http://www.richardsonrfpd.com/pages/Product-Details.aspx?productId=670116
L3 = SparkFun-Passives:INDUCTOR: Inductors Basic Inductor/Choke - 0603 and 1206. Footprints are not proven and vary greatly between part numbers. INDUCTOR POWER 3.3UH 4.0A SMD 0.197" L x 0.197" W x 0.177" H (5.00mm x 5.00mm x 4.50mm); COILCRAFT: 1606
L4 L5 = SparkFun-Passives:INDUCTOR: Inductors Basic Inductor/Choke - 0603 and 1206. Footprints are not proven and vary greatly between part numbers. INDUCTOR POWER 3.3UH 4.0A SMD 0.197" L x 0.197" W x 0.177" H (5.00mm x 5.00mm x 4.50mm); DIGI: 490-3992-1-ND; MPN: BLM18EG221SN1D
R1-R15 R18-R28 R30-R44 = SparkFun-Resistors:RESISTOR: Resistor Basic schematic elements and footprints for 0603, 1206, and PTH resistors.
R29 = SparkFun-Resistors:RESISTOR: Resistor Basic schematic elements and footprints for 0603, 1206, and PTH resistors.; DIGI: P287LCT-ND; MPN: ERJ-2RKF2870X
SJ2 SJ4 SJ5 = SparkFun-Passives:JUMPER-PAD-3-2OF3_NC_BY_TRACE
SJ6 = SparkFun-Passives:JUMPER-PAD-2-NO
T1 T2 = RitLaunchInitiative:DC08-73: Directional Coupler 300Mhz - 2.7Ghz; DIGI: 863-1243-1-ND; MPN: DC08-73LF
U1 U2 = RitLaunchInitiative:TPS2561
U3 = RitLaunchInitiative:LM75B: I2c temperature sensor|Output Switch, Programmable Limit, Shutdown Mode| http://www.nxp.com/documents/data_sheet/LM75B.pdf; DIGI: 568-9815-1-ND; MPN: LM75BTP
U4 U5 = RitLaunchInitiative:LTC5505: RF power detector 300Mhz to 3Ghz; DIGI: LTC5505-2ES5#TRMPBFCT-ND; MPN: LTC5505-2ES5#TRMPBF
U6 = RitLaunchInitiative:MCP4728: 4 channel I2C DAC
U7 = RitLaunchInitiative:ADC128D818: 8 Channel i2c ADC. Pseudo-Differential, Single Ended| 3 V ~ 5.5 V| http://www.ti.com/lit/ds/symlink/adc128d818.pdf; DIGI: 296-41182-1-ND; MPN: ADC128D818CIMTX/NOPB
U8 = RitLaunchInitiative:MIC5504-3.3YM5: IC REG LDO 3.3V 0.3A SOT-23-5 | http://www.micrel.com/_PDF/MIC550X.pdf; DIGI: 576-4764-1-ND; MPN: MIC5504-3.3YM5 TR
U9 = RitLaunchInitiative:TCA9535: IC I/O EXPANDER I2C 16B 24WQFN | http://www.ti.com/lit/ds/symlink/tca9535.pdf |
U$1 = RitLaunchInitiative:SI4463
U$2 = RitLaunchInitiative:RF6886; DIGI: 689-1091-1-ND
U$3 = RitLaunchInitiative:PE42423
U$4 U$8 U$11 = RitLaunchInitiative:SN74LVC1G14: SN74LVC1G14 Single Schmitt-Trigger Inverter; DIGI: 296-11607-1-ND; MPN: SN74LVC1G14DBVR
U$6 = RitLaunchInitiative:TL331-Q1: Single differencial comparator; Rail to rail; High temperature version; DIGI: 296-37702-1-ND; MPN: TL331QDBVRQ1
U$7 = RitLaunchInitiative:SN74AHC1G08: SN74AHC1G08 Single 2-Input Positive-AND Gate; DIGI: 296-1091-1-ND; MPN: SN74AHC1G08DBVR
U$9 = RitLaunchInitiative:SN74LVC1G32: SN74LVC1G32 Single 2-Input Positive-OR Gate; DIGI: 296-28376-1-ND; MPN: SN74LVC1G32DSFR
U$10 = RitLaunchInitiative:0732511150_SMA_EDGE_LAUNCH: CONN SMA JACK 50 OHM EDGE MNT; DIGI: WM5534-ND; MPN: 0732511150
U$12 = RitLaunchInitiative:DFLT13A-7: TVS DIODE 13VWM POWERDI123 | 12v; DIGI: DFLT13ADICT-ND; MPN: DFLT13A-7
U$13 = RitLaunchInitiative:RADIO_HEAD_EDGECONNECTOR
U$15 = RitLaunchInitiative:LMZ31704: Switching Buck converter | DC/DC CONVERTER 0.6-5.5V 22W QFN|http://www.ti.com/lit/ds/symlink/lmz31704.pdf; DIGI: 296-37135-1-ND; MPN: LMZ31704RVQT
U$16 U$20 U$21 = RitLaunchInitiative:THERMISTOR; DIGI: 490-4801-1-ND; MPN: NCP15XH103F03RC
Y1 = RitLaunchInitiative:CRYSTAL; DIGI: 887-1330-1-ND; MPN: 7M-30.000MEEQ-T

## Net classes
1 RF Path: width 1.016 mm, clearance 0.178 mm to class 0

## Board
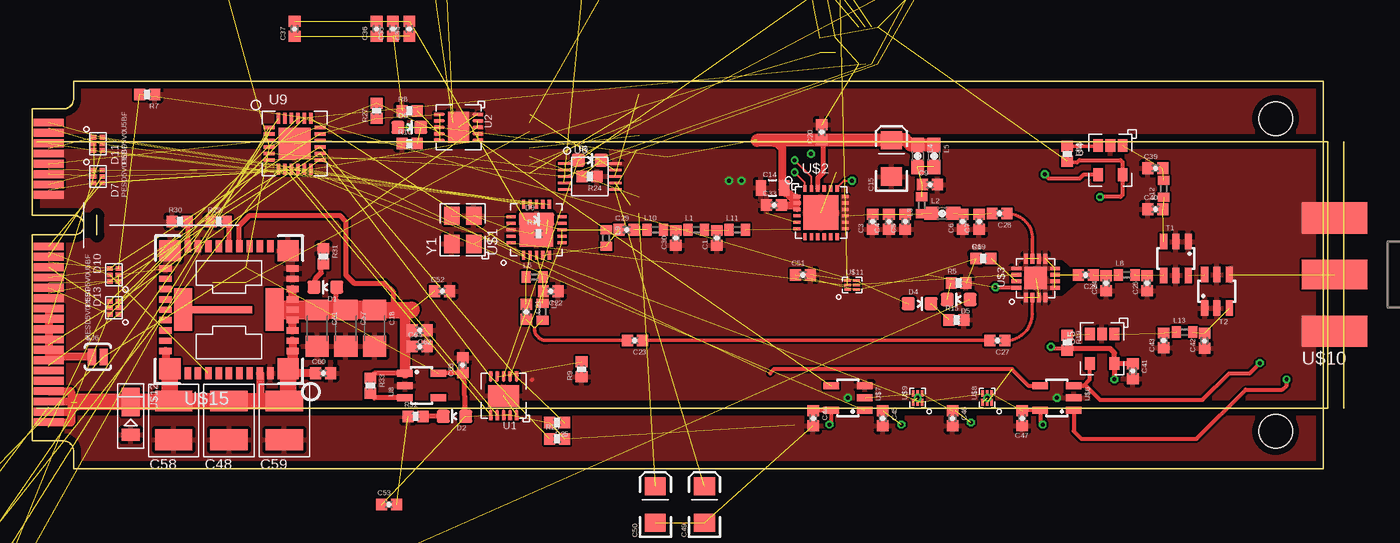
[diagram p5: board, top side]
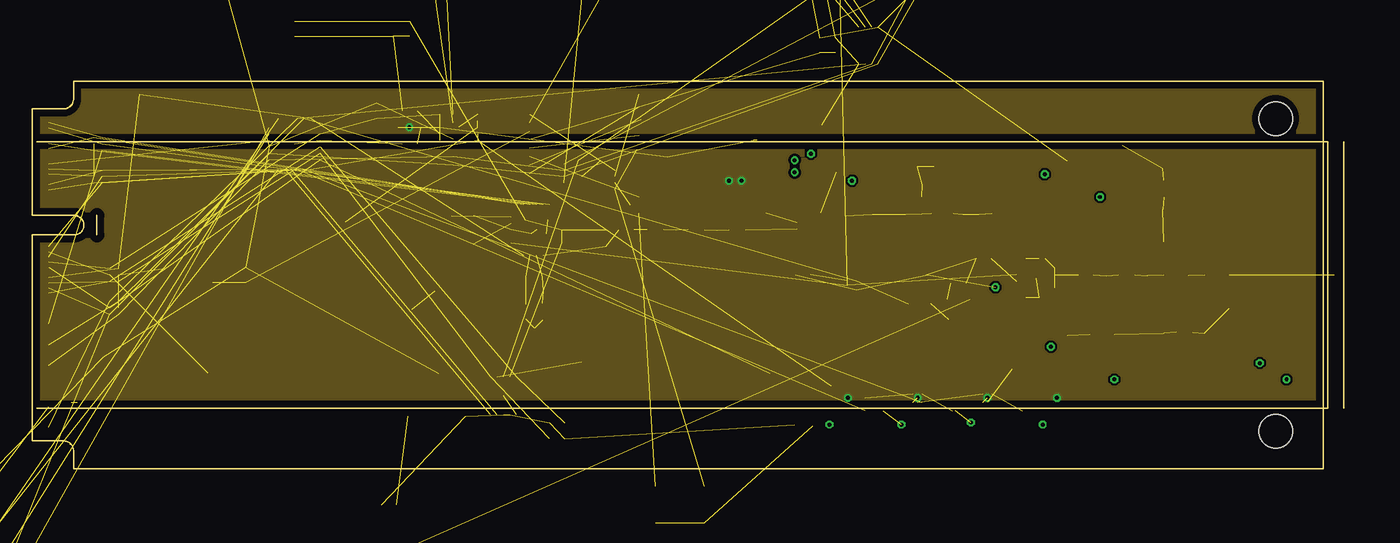
[diagram p6: board, inner layer Route2]
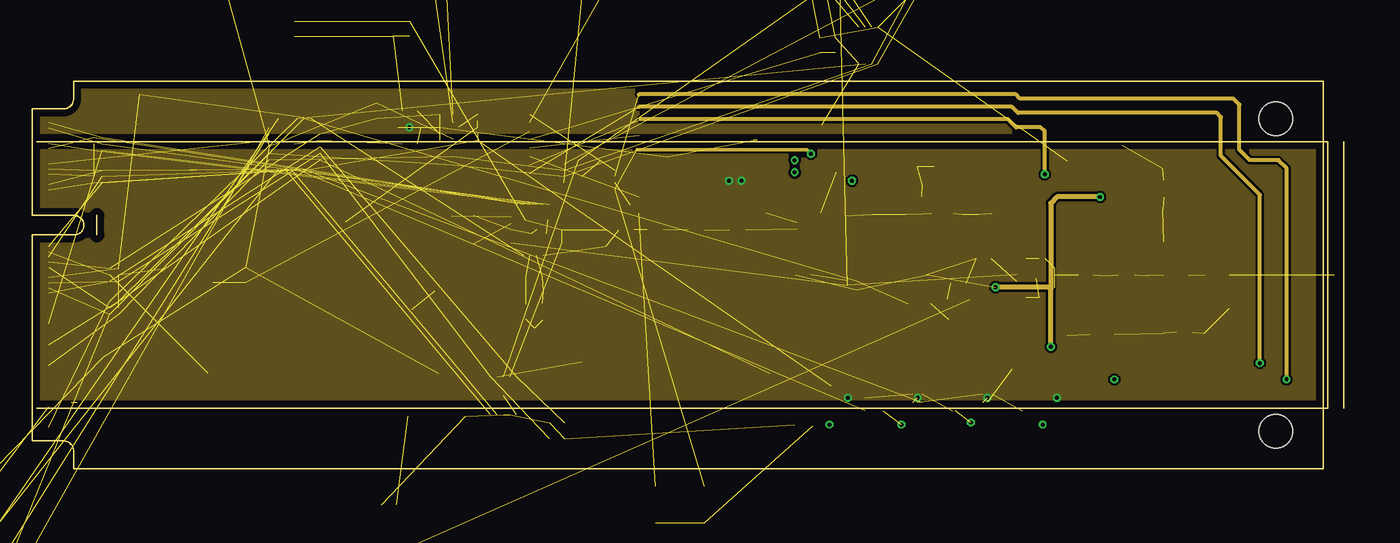
[diagram p7: board, inner layer Route15]
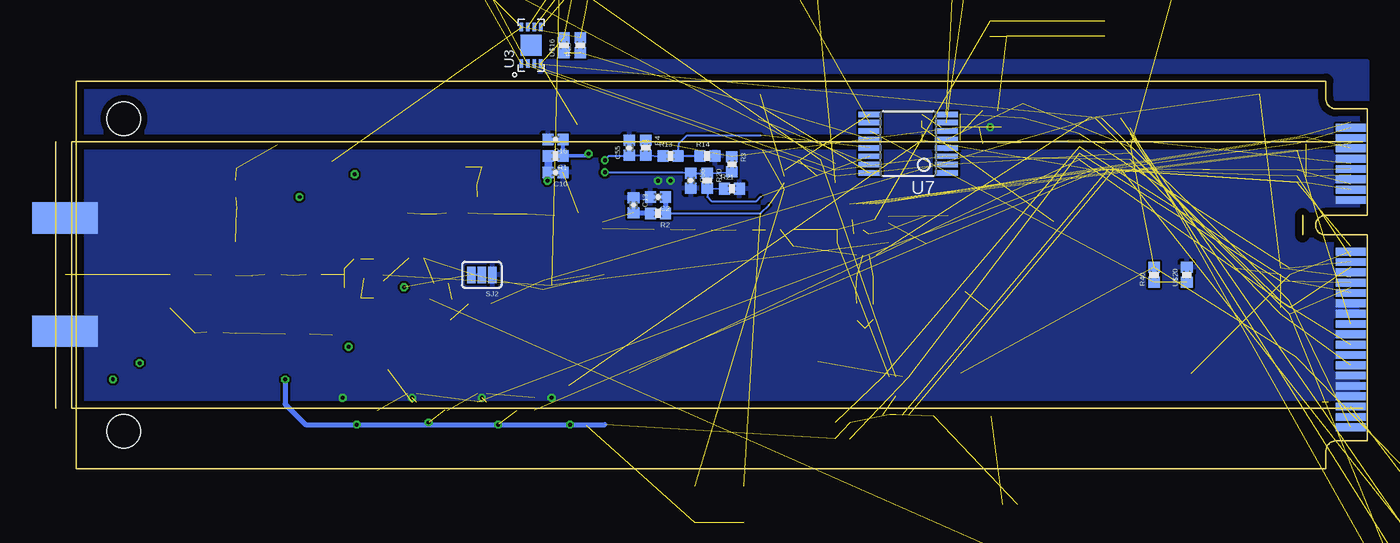
[diagram p8: board, bottom side, seen from below]

Size 101.6 x 30 mm. Coordinates in mm from the lower left corner, seen from the top.
Copper layers (1*2*15*16): Top 0.035mm / dielectric 0.12mm / Route2 0.035mm / dielectric 0.6mm / Route15 0.035mm / dielectric 0.12mm / Bottom 0.035mm
Design rules "ShenZhen4Layer EagleRules *": minimum track width 7mil, minimum drill 12mil, track to track 7mil, track to pad 7mil, pad to pad 7mil, via to via 7mil, smd to smd 0mil, copper to edge 20mil, drill to drill 10mil, minimum pad ring 10mil, minimum via ring 6mil, stop-mask expansion 2mil, vias tented up to drill 25mil, thermal gap 10mil
tRestrict: 2 lines

### Footprints (pad centres in the part's own frame; a part is rotated, then mirrored left to right if it is on the bottom)
0402-CAP = smd 0.85 x 0.9: 1 -0.58,0; 2 0.58,0
0805 = smd 0.8 x 1.2: 1 -0.9,0; 2 0.9,0
EIA3216 = smd 1.4 x 1.6: A 1.4,0; C -1.4,0
1206 = smd 1.6 x 1.8: 1 -1.4,0; 2 1.4,0
CERAMIC_CAP_1210 = smd 1.6 x 2.9: P$1 -1.5,0; P$2 1.5,0
LED-0603 = smd 1 x 1: A 0,-0.877; C 0,0.877
6-XFDFN = smd 0.425 x 0.37: P$1 -0.338,0.5; P$2 -0.338,0; P$3 -0.338,-0.5; P$4 0.338,-0.5; P$5 0.338,0; P$6 0.338,0.5
C0402 = smd 0.7 x 0.9: 1 -0.65,0; 2 0.65,0
0603 = smd 1.1 x 1: 1 -0.85,0; 2 0.85,0
0402-RES = smd 0.85 x 0.9: 1 -0.58,0; 2 0.58,0
PAD-JUMPER-3-2OF3_NC_BY_TRACE_YES_SILK_FULL_BOX = smd 0.635 x 1.27: 1 -0.813,0; 2 0,0; 3 0.813,0
PAD-JUMPER-2-NO_YES_SILK = smd 0.635 x 1.27: 1 -0.45,0; 2 0.45,0
SOT23-6 = smd 1.2 x 0.55: 1 -1.3,0.95; 2 -1.3,0; 3 -1.3,-0.95; 4 1.3,-0.95; 5 1.3,0; 6 1.3,0.95
10-VFDFN = smd 2.4 x 1.65: GNDPAD 0,0 | smd 0.28 x 0.85: P$1 -1,1.475; P$2 -0.5,1.475; P$3 0,1.475; P$4 0.5,1.475; P$5 1,1.475; P$6 1,-1.475; P$7 0.5,-1.475; P$8 0,-1.475; P$9 -0.5,-1.475; P$10 -1,-1.475
HWSON8 = smd 0.625 x 0.25: P$1 -1.413,0.75; P$2 -1.413,0.25; P$3 -1.413,-0.25; P$4 -1.413,-0.75; P$5 1.413,-0.75; P$6 1.413,-0.25; P$7 1.413,0.25; P$8 1.413,0.75 | smd 1.6 x 1.6: PAD 0,0
TSOT-23-5 = smd 0.754 x 0.981: P$1 -0.95,-1.137; P$2 0,-1.137; P$3 0.95,-1.137; P$4 0.95,1.137; P$5 -0.95,1.137
10-MSOP = smd 0.95 x 0.2: P$1 -1.975,1; P$2 -1.975,0.5; P$3 -1.975,0; P$4 -1.975,-0.5; P$5 -1.975,-1; P$6 1.975,-1; P$7 1.975,-0.5; P$8 1.975,0; P$9 1.975,0.5; P$10 1.975,1
16-TSSOP = smd 0.42 x 1.78: 1 -2.275,-2.97; 2 -1.625,-2.97; 3 -0.975,-2.97; 4 -0.325,-2.97; 5 0.325,-2.97; 6 0.975,-2.97; 7 1.625,-2.97; 8 2.275,-2.97; 9 2.275,2.97; 10 1.625,2.97; 11 0.975,2.97; 12 0.325,2.97; 13 -0.325,2.97; 14 -0.975,2.97; 15 -1.625,2.97; 16 -2.275,2.97
SOT23-5 = smd 1.2 x 0.55: 1 -1.3,0.95; 2 -1.3,0; 3 -1.3,-0.95; 4 1.3,-0.95; 5 1.3,0.95
24-WQFN = smd 2.45 x 2.45: GND_PAD 0,0 | smd 0.28 x 0.85: P$1 -1.25,1.975; P$2 -0.75,1.975; P$3 -0.25,1.975; P$4 0.25,1.975; P$5 0.75,1.975; P$6 1.25,1.975; P$13 1.25,-1.975; P$14 0.75,-1.975; P$15 0.25,-1.975; P$16 -0.25,-1.975; P$17 -0.75,-1.975; P$18 -1.25,-1.975 | smd 0.85 x 0.28: P$7 1.975,1.25; P$8 1.975,0.75; P$9 1.975,0.25; P$10 1.975,-0.25; P$11 1.975,-0.75; P$12 1.975,-1.25; P$19 -1.975,-1.25; P$20 -1.975,-0.75; P$21 -1.975,-0.25; P$22 -1.975,0.25; P$23 -1.975,0.75; P$24 -1.975,1.25
20-VFQFN = smd 2.6 x 2.6: GND_PAD 0,0 | smd 0.7 x 0.25: P$1 -1.975,1; P$2 -1.975,0.5; P$3 -1.975,0; P$4 -1.975,-0.5; P$5 -1.975,-1; P$11 1.975,-1; P$12 1.975,-0.5; P$13 1.975,0; P$14 1.975,0.5; P$15 1.975,1 | smd 0.25 x 0.7: P$6 -1,-1.975; P$7 -0.5,-1.975; P$8 0,-1.975; P$9 0.5,-1.975; P$10 1,-1.975; P$16 1,1.975; P$17 0.5,1.975; P$18 0,1.975; P$19 -0.5,1.975; P$20 -1,1.975
24-VFQFN = smd 0.528 x 0.26: P$1 -1.864,1.25; P$2 -1.864,0.75; P$3 -1.864,0.25; P$4 -1.864,-0.25; P$5 -1.864,-0.75; P$6 -1.864,-1.25; P$13 1.864,-1.25; P$14 1.864,-0.75; P$15 1.864,-0.25; P$16 1.864,0.25; P$17 1.864,0.75; P$18 1.864,1.25 | smd 0.26 x 0.528: P$7 -1.25,-1.864; P$8 -0.75,-1.864; P$9 -0.25,-1.864; P$10 0.25,-1.864; P$11 0.75,-1.864; P$12 1.25,-1.864; P$19 1.25,1.864; P$20 0.75,1.864; P$21 0.25,1.864; P$22 -0.25,1.864; P$23 -0.75,1.864; P$24 -1.25,1.864 | smd 2.7 x 2.7: P$GND_PAD 0,0
16-QFN = smd 0.75 x 0.3: P$1 -1.5,0.75; P$2 -1.5,0.25; P$3 -1.5,-0.25; P$4 -1.5,-0.75; P$9 1.5,-0.75; P$10 1.5,-0.25; P$11 1.5,0.25; P$12 1.5,0.75 | smd 0.3 x 0.75: P$5 -0.75,-1.5; P$6 -0.25,-1.5; P$7 0.25,-1.5; P$8 0.75,-1.5; P$13 0.75,1.5; P$14 0.25,1.5; P$15 -0.25,1.5; P$16 -0.75,1.5 | smd 1.75 x 1.75: P$GNDPAD 0,0
6-SON = smd 0.2 x 0.53: P$1 -0.35,0.34; P$2 0,0.34; P$3 0.35,0.34; P$4 0.35,-0.34; P$5 0,-0.34; P$6 -0.35,-0.34
SMA_EDGE_LAUNCH = smd 5.08 x 2.415 bottom: GND@1 2.54,4.383; GND@3 2.54,-4.383 | smd 5.08 x 2.415: GND@2 2.54,4.383; GND@5 2.54,-4.383 | smd 5.08 x 2.29: P 2.54,0
POWERDI®123 = smd 0.9 x 1.4: ANODE 0.95,0 | smd 2.2 x 1.4: CATHODE -1.6,0
PCIE_MINI_CARDEDGE = smd 2.3 x 0.6: P$1 -1.275,-11.8; P$3 -1.275,-11; P$5 -1.275,-10.2; P$7 -1.275,-9.4; P$9 -1.275,-8.6; P$11 -1.275,-7.8; P$13 -1.275,-7; P$15 -1.275,-6.2; P$17 -1.275,-2.2; P$19 -1.275,-1.4; P$21 -1.275,-0.6; P$23 -1.275,0.2; P$25 -1.275,1; P$27 -1.275,1.8; P$29 -1.275,2.6; P$31 -1.275,3.4; P$33 -1.275,4.2; P$35 -1.275,5; P$37 -1.275,5.8; P$39 -1.275,6.6; P$41 -1.275,7.4; P$43 -1.275,8.2; P$45 -1.275,9; P$47 -1.275,9.8; P$49 -1.275,10.6; P$51 -1.275,11.4 | smd 2.3 x 0.6 bottom: P$2 -1.275,-11.4; P$4 -1.275,-10.6; P$6 -1.275,-9.8; P$8 -1.275,-9; P$10 -1.275,-8.2; P$12 -1.275,-7.4; P$14 -1.275,-6.6; P$16 -1.275,-5.8; P$18 -1.275,-1.8; P$20 -1.275,-1; P$22 -1.275,-0.2; P$24 -1.275,0.6; P$26 -1.275,1.4; P$28 -1.275,2.2; P$30 -1.275,3; P$32 -1.275,3.8; P$34 -1.275,4.6; P$36 -1.275,5.4; P$38 -1.275,6.2; P$40 -1.275,7; P$42 -1.275,7.8; P$44 -1.275,8.6; P$46 -1.275,9.4; P$48 -1.275,10.2; P$50 -1.275,11; P$52 -1.275,11.8 | hole 2.6: -96.31,-12.1; -96.31,12.1
42-QFN = smd 1.65 x 1.65: P$1 -4.575,4.575; P$11 4.575,4.575; P$21 4.575,-4.575; P$31 -4.575,-4.575 | smd 0.5 x 0.95: P$2 -3.2,4.925; P$3 -2.4,4.925; P$4 -1.6,4.925; P$5 -0.8,4.925; P$6 0,4.925; P$7 0.8,4.925; P$8 1.6,4.925; P$9 2.4,4.925; P$10 3.2,4.925; P$22 3.2,-4.925; P$23 2.4,-4.925; P$24 1.6,-4.925; P$25 0.8,-4.925; P$26 0,-4.925; P$27 -0.8,-4.925; P$28 -1.6,-4.925; P$29 -2.4,-4.925; P$30 -3.2,-4.925 | smd 0.95 x 0.5: P$12 4.925,3.2; P$13 4.925,2.4; P$14 4.925,1.6; P$15 4.925,0.8; P$16 4.925,0; P$17 4.925,-0.8; P$18 4.925,-1.6; P$19 4.925,-2.4; P$20 4.925,-3.2; P$32 -4.925,-3.2; P$33 -4.925,-2.4; P$34 -4.925,-1.6; P$35 -4.925,-0.8; P$36 -4.925,0; P$37 -4.925,0.8; P$38 -4.925,1.6; P$39 -4.925,2.4; P$40 -4.925,3.2 | smd 1.4 x 3.29: P$41 -3.55,0; P$42 3.55,0 | smd 4.65 x 0.525: P$42L 0.525,0
0402 = smd 0.85 x 0.9: 1 -0.58,0; 2 0.58,0
4-SMD_3.2_X_2.5 = smd 1.4 x 1.2: P$1 -1.1,-0.85; P$2 1.1,-0.85; P$3 1.1,0.85; P$4 -1.1,0.85

### Placement (x,y rotation side)
C1  53.02,17.86 90 top
C2  54.93,21.03 180 bottom
C3  65.09,19.13 90 top
C4  66.36,19.13 90 top
C5  67.63,19.13 90 top
C6  72.07,19.13 90 top
C7  73.34,19.13 90 top
C8  59.69,42.94 180 top  (outside the outline)
C9  69.53,21.98 0 top
C10  62.87,22.94 180 bottom
C11  96.52,54.37 180 top  (outside the outline)
C12  78.74,73.42 90 top  (outside the outline)
C13  56.83,20.4 270 bottom
C14  57.34,21.73 0 top
C15  66.55,24.02 90 top
C16  62.87,25.48 180 bottom
C17  96.52,58.18 180 top  (outside the outline)
C18  26.51,10.87 270 top
C19  73.66,16.27 0 top
C20  61.15,26.05 90 top
C21  38.26,12.14 270 top
C22  40.16,13.73 180 top
C23  46.67,9.92 180 top
C24  83.19,14.37 90 top
C25  86.36,14.37 90 top
C26  81.6,15 180 top
C27  74.77,9.92 180 top
C28  74.93,19.76 180 top
C29  46.04,18.49 0 top
C30  49.85,17.86 90 top
C31  62.23,50.56 90 top  (outside the outline)
C32  -5.08,-2.78 0 top  (outside the outline)
C33  57.47,20.4 0 top
C34  29.21,34.05 90 top  (outside the outline)
C35  27.94,34.05 90 top  (outside the outline)
C36  26.67,34.05 90 top  (outside the outline)
C37  20.32,34.05 90 top  (outside the outline)
C38  13.97,59.45 0 top  (outside the outline)
C39  87,23.26 0 top
C40  87,20.08 0 top
C41  85.25,7.54 270 top
C42  90.79,9.89 90 top
C43  87.63,9.92 90 top
C44  60.48,3.89 270 top
C45  65.88,3.89 270 top
C46  71.28,3.89 270 top
C47  76.68,3.89 270 top
C48  15.24,3.73 270 top
C49  52.07,-2.78 90 top
C50  48.26,-2.78 90 top
C51  59.69,15 0 top
C52  31.75,13.73 0 top
C53  27.62,-2.78 0 top
C54  -17.78,-25.64 0 top  (outside the outline)
C55  57.15,24.84 90 bottom
C56  52.39,22.3 270 bottom
C57  24.29,10.87 270 top
C58  10.95,3.73 270 top
C59  19.53,3.73 270 top
C60  22.54,7.38 0 top
C61  22.07,10.87 270 top
C62  30,10.71 180 top
C63  33.34,8.02 90 top
C64  30,9.44 0 top
C65  8.89,56.91 180 top  (outside the outline)
C66  8.89,60.72 180 top  (outside the outline)
D1  22.7,14.05 90 top
D2  32.7,4.05 90 top
D3  -10.16,-14.21 0 top  (outside the outline)
D4  68.74,12.78 270 top
D5  71.75,13.1 90 top
D6  29.21,26.43 270 top
D7  5.08,22.62 0 top
D8  43.18,23.89 270 top
D9  39.05,19.29 270 top
D10  6.35,15 180 top
D11  5.08,25.16 0 top
D13  6.35,12.46 180 top
L1  51.44,18.49 0 top
L2  70.48,19.76 0 top
L3  68.9,20.4 90 top
L4  68.58,24.21 270 top
L5  69.85,24.21 270 top
L6  38.89,14.84 0 top
L7  39.53,12.14 270 top
L8  84.77,15 0 top
L9  44.45,17.86 270 top
L10  48.26,18.49 0 top
L11  54.61,18.49 0 top
L12  87.63,21.67 90 top
L13  89.26,10.57 0 top
R1  62.87,24.21 180 bottom
R2  54.93,19.76 180 bottom
R3  49.21,23.57 270 bottom
R4  55.88,24.84 270 bottom
R5  71.75,14.37 0 top
R6  73.66,16.27 0 top
R7  8.89,28.97 180 top
R8  29.21,27.7 0 top
R9  42.55,7.7 90 top
R10  29.21,25.16 0 top
R11  -5.08,-6.59 0 top  (outside the outline)
R12  39.21,18.17 0 top
R13  53.98,24.21 0 bottom
R14  51.12,24.21 0 bottom
R15  71.6,11.51 0 top
R18  80.17,24.37 270 top
R19  80.17,9.76 270 top
R20  51.12,22.3 270 bottom
R21  49.21,21.67 0 bottom
R22  91.44,79.77 0 top  (outside the outline)
R23  91.44,75.96 0 top  (outside the outline)
R24  43.18,22.62 180 top
R25  40.64,3.57 180 top
R26  40.64,2.3 0 top
R27  26.67,27.7 90 top
R28  60.96,32.78 90 bottom
R29  14.45,19.13 0 top
R30  11.43,19.13 0 top
R31  22.54,16.43 270 top
R32  29.69,4.05 0 top
R33  26.19,6.43 270 top
R34  26.67,68.34 90 top  (outside the outline)
R35  30.48,68.34 90 top  (outside the outline)
R36  34.29,68.34 90 top  (outside the outline)
R37  38.1,68.34 90 top  (outside the outline)
R38  41.91,68.34 90 top  (outside the outline)
R39  45.72,68.34 90 top  (outside the outline)
R40  16.51,15 90 bottom
R41  66.04,75.96 90 top  (outside the outline)
R42  -5.08,-10.4 0 top  (outside the outline)
R43  -5.08,-14.21 0 top  (outside the outline)
R44  -8.89,-18.02 0 top  (outside the outline)
SJ2  68.58,15 180 bottom
SJ4  95.25,51.83 180 top  (outside the outline)
SJ5  90.17,58.18 0 top  (outside the outline)
SJ6  5.08,8.65 0 top
T1  88.58,16.27 270 top
T2  91.76,13.73 90 top
U1  36.51,5.63 180 top
U2  33.02,26.43 270 top
U3  64.77,32.78 90 bottom
U4  83.5,23.89 180 top
U5  82.87,9.29 180 top
U6  43.18,22.62 0 top
U7  35.56,25.16 90 bottom
U8  30.16,6.43 0 top
U9  20.32,25.16 0 top
U$1  39.05,18.49 90 top
U$2  61.1,19.83 0 top
U$3  77.72,14.75 90 top
U$4  -7.62,-21.83 0 top  (outside the outline)
U$5  [PCIE_36_CARDEDGE]  100.33,15 0 top
U$6  79.38,5.47 180 top
U$7  63.18,5.47 180 top
U$8  73.98,5.47 180 top
U$9  68.58,5.47 180 top
U$10  103.4,15.03 180 top
U$11  63.5,14.21 90 top
U$12  7.62,3.57 270 top
U$13  0,15 180 top
U$15  15.24,12.3 180 top
U$16  62.23,32.78 90 bottom
U$20  13.97,15 90 bottom
U$21  69.85,75.96 90 top  (outside the outline)
Y1  33.34,18.49 90 top

### Tracks (layer width: path | path; a pad name or v marks a point on that pad's centre or on a via)
3.3V  (via drill 0.3 pad 0.15)  (32 unrouted)
  Top 0.305: C47.1 76.85,4.52 U$6.5 78.1,4.52 78.11,4.52 78.11,3.57 v78.26,3.41 | 71.45,4.52 C46.1 | C44.1 61.87,4.54 U$7.5 61.88,3.54 v61.75,3.41 | 67.28,3.44 v67.31,3.41 | 72.68,3.6 v72.71,3.57 | 85.21,8.15 C41.1 | v83.82,6.91 v83.82,6.9 | R19.2 80.34,9.29 79.06,9.29 v78.9,9.44 | U$3.P$16 74.66,14 v74.61,14.05 | v82.71,21.03 84.3,21.03 84.45,21.19 U4.P$5 84.45,23.73 84.3,23.89 81.12,23.89 80.95,23.72 R18.2
  Top 0.406: U8.5 31.48,7.37 C63.1 33.45,7.25 D2.A | U5.P$5 85.21,8.15 | U5.P$5 v83.82,6.91 | U5.P$5 83.82,8.97 83.5,9.29 80.34,9.29
  Route15 0.406: v78.9,9.44 78.9,13.89 | 78.9,13.89 78.74,14.05 v74.61,14.05 | v82.71,21.03 79.38,21.03 78.9,20.56 78.9,13.89
  Bottom 0.305: v61.75,3.41 v67.31,3.41 72.55,3.41 v72.71,3.57
  Bottom 0.406: 59.05,3.41 v61.75,3.41 v78.26,3.41 82.23,3.41 83.82,5 v83.82,6.9
3.6V  (3 unrouted)
  Top 0.406: U$15.P$27 16.04,18.82 16.83,19.6 23.81,19.6 24.29,19.13 24.29,15 24.92,14.37 27.3,14.37 27.94,13.73 27.94,12.3 | 27.94,12.3 26.54,12.3 C18.1 | D1.A 23.45,13.11 C57.1 | U8.1 26.49,7.38 R33.1 | C62.2 28.86,10.71 | C64.1 28.86,9.44 | 28.86,12.24 28,12.24 27.94,12.3
  Top 0.61: U$15.P$38 U$15.P$36 U$15.P$35 U$15.P$34
  Top 0.813: U$15.P$37 U$15.P$36 | U8.1 28.86,9.44 28.86,10.71 28.86,12.24 28.89,12.27
  Top 1.27: C57.1 28.89,12.27 29.34,12.27 29.37,12.3
  Top 1.422: U$15.P$36 U$15.P$41 18.82,12.27 20.14,12.27 | U$15.P$36 26.48,12.3 C18.1 | C61.1 20.14,12.27 | 20.14,12.27 U$15.P$36
3V6_PWRGD  (2 unrouted)
12V  (1 unrouted)
  Top 0.61: U$15.P$12 10.31,8.08 U$15.P$11 | U$15.P$3 17.64,5.25 17.62,5.23 | U$15.P$39 20.16,8.49 | U$13.P$45 2.97,6 3.02,5.95 3.02,5.16 | 3.02,5.16 3.02,4.21 | 3.02,4.21 3.02,3.57 1.3,3.57 U$13.P$51 | U$13.P$49 2.82,4.4 3.02,4.21 | U$13.P$47 2.97,5.2 3.02,5.16 | C60.1 20.16,7.38 U$15.P$1
  Top 0.813: U$15.P$40 20.16,8.49 20.16,8.08 U$15.P$1
  Top 1.27: C58.P$1 C48.P$1 17.62,5.23 C59.P$1 19.82,5.52 U$15.P$1 | C58.P$1 10.95,5.47 10.64,5.79 10.64,7.7 U$15.P$11 | C58.P$1 10.89,5.17 U$12.CATHODE 3.5,5.17 3.49,5.16
BUCK_TEMP  (2 unrouted)
BUFF_TR_SWITCH_CTL  (5 unrouted)
DAC_3V3  (2 unrouted)
DAC_PWR_EN  (3 unrouted)
DAC_PWR_FAULT  (4 unrouted)
EXPANDER_IRQ  (1 unrouted)
GND  (via drill 0.3 pad 0.15)  (53 unrouted)
  Top 0.305: 38.69,6.86 38.73,6.9
  other vias: 29.21,26.43 54.93,22.3 53.98,22.3 63.18,5.47 68.58,5.47 73.98,5.47 79.38,5.47
  pour Bottom: 0,31.51 100.33,31.51 100.33,-0.24 0,-0.24
  pour Route2: -10.16,30.24 100.33,30.24 100.33,-0.24 -10.16,-0.24
  pour Route15: -7.62,30.24 100.33,30.24 100.33,-0.24 -7.62,-0.24
  pour Top: -3.81,30.24 100.33,30.24 100.33,-0.24 -3.81,-0.24
N$1  (2 unrouted)
N$2  (via drill 0.3 pad 0.15)
  Top 0.152: U$2.P$19 62.35,21.79 62.87,22.3 v63.5,22.3
  Bottom 0.152: v63.5,22.3 63.5,22.92 C10.2
  Bottom 0.61: R1.2 C10.2
N$3  (1 unrouted)
N$4  (1 unrouted)
N$5  (3 unrouted)
N$6  (3 unrouted)
N$7
  Top 0.61: SJ6.1 1.52,8.65 U$13.P$39 U$13.P$37 U$13.P$35 U$13.P$33 U$13.P$31 U$13.P$29
N$8  (5 unrouted)
  pour Top (isolate 0.178, no thermals): 62.69,21.2 63.23,21.2 64.35,20.22 64.35,19.45 63.23,18.45 62.69,18.45
  cutout Top (isolate 0.178, no thermals): 79.2,16.12 79.74,16.12 80.86,15.14 80.86,14.37 79.74,13.37 79.2,13.37
N$9  (1 unrouted)
  Bottom 0.406: R2.2 56.82,19.76 C13.2
N$10  (2 unrouted)
N$11  (1 unrouted)
N$12  (2 unrouted)
N$13  (2 unrouted)
  Top 0.254: C23.2 39.85,9.92 arc-90 38.89,10.87
N$14
  Top 0.254: C27.2 C23.1
N$15  (2 unrouted)
N$16  (1 unrouted)
  pour Top (no thermals): 79.6,15.15 80.6,15.45 80.6,14.55 79.6,14.85 79.6,15.15
N$17  (1 unrouted)
N$18  (1 unrouted)
N$19  (1 unrouted)
N$20  (2 unrouted)
N$21  (1 unrouted)
N$22  (2 unrouted)
N$23
  Top 0.219: C27.1 arc90 77.47,11.97 U$3.P$2
N$24
  Top 0.251: C28.1 arc-90 77.47,17.8
  Top 0.264: 77.47,17.8 U$3.P$11
N$25  (1 unrouted)
N$26  (1 unrouted)
N$27  (3 unrouted)
N$28  (1 unrouted)
N$29  (1 unrouted)
N$30  (1 unrouted)
N$31  (1 unrouted)
N$32  (1 unrouted)
N$33  (1 unrouted)
N$34  (1 unrouted)
N$36  (1 unrouted)
N$37
  Top 0.305: R18.1 82.54,25.02 U4.P$3
N$39  (2 unrouted)
N$40  (2 unrouted)
N$41  (1 unrouted)
N$42  (1 unrouted)
N$43  (2 unrouted)
N$44  (2 unrouted)
N$45  (1 unrouted)
  pour Top (no thermals): 92.43,15.63 94.51,16.17 94.51,13.88 92.43,14.43
N$47  (via drill 0.3 pad 0.15)
  Top 0.152: U$2.P$23 60.35,22.59 v59.05,23.89
  Bottom 0.152: v59.05,23.89 58.74,24.21 57.16,24.21 C55.1 R4.2 54.64,24.19 R13.1
N$48  (via drill 0.3 pad 0.15)
  Top 0.152: U$2.P$24 59.85,22.14 v59.05,22.94
  Bottom 0.152: v59.05,22.94 53.01,22.94 C56.1 R20.1 49.24,22.95 R3.2
N$49  (3 unrouted)
N$50  (1 unrouted)
N$53  (1 unrouted)
N$54
  Top 0.406: U$15.P$26 15.24,18.98 R29.2
N$55
  Top 0.406: R30.2 12.08,17.27 U$15.P$22
N$56
  Top 0.406: D2.C R32.2
N$57
  Top 0.406: U8.3 26.49,5.48 R33.2
N$58
  Top 0.406: D1.C 21.95,14.73 22.38,15.16 22.38,15.62 R31.2
N$59  (1 unrouted)
N$60  (1 unrouted)
N$61  (1 unrouted)
N$62  (1 unrouted)
N$63  (1 unrouted)
N$64  (1 unrouted)
N$65  (1 unrouted)
N$66  (1 unrouted)
N$67  (1 unrouted)
N$68  (1 unrouted)
N_IRQ  (2 unrouted)
N_SEL  (2 unrouted)
PA_3V6  (5 unrouted)
  Top 0.406: 66.91,25.06 C15.A | U$2.P$22 60.85,22.51 61.28,22.94 61.28,25.27 C20.1 | U$2.P$3 U$2.P$2 U$2.P$1 59.01,21.08 58.74,21.35 58.42,21.35 | 58.42,21.35 58.3,21.35 C14.2 | 58.42,21.35 58.1,21.67
  Top 0.61: 58.1,21.67 58.1,24.78 57.47,25.42 | 58.3,21.35 58.46,21.35 U$2.P$2 59.06,20.4 C33.2
  Top 1.016: L5.1 L4.1 68.05,25.06 67.63,25.48 66.61,25.48 C15.A 61.17,25.42 | 61.17,25.42 C20.1 | 61.17,25.42 57.47,25.42 56.14,25.42
PA_BREAKER_OVERRIDE  (3 unrouted)
PA_LOADSWITCH_TEMP  (2 unrouted)
PA_OVERTEMP_ALARM  (3 unrouted)
PA_PWR_EN  (3 unrouted)
PA_PWR_EN_BREAKER  (5 unrouted)
PA_PWR_FAULT  (5 unrouted)
PA_PWR_REF  (1 unrouted)
  Bottom 0.152: R21.1 49.88,21.65 R20.2 51.12,21.03 50.8,20.71 47.31,20.71 46.99,21.03
PA_PWR_SENSE  (1 unrouted)
  Bottom 0.152: R14.1 R13.2 53.33,25.17 52.7,25.8 46.99,25.8
PA_TEMP  (2 unrouted)
RADIO_3V3  (8 unrouted)
RADIO_PWR_EN  (3 unrouted)
RADIO_PWR_FAULT  (4 unrouted)
RADIO_SHUTDOWN  (4 unrouted)
REFLECTED_POWER_REF  (via drill 0.3 pad 0.15)  (1 unrouted)
  Top 0.305: U$6.1 80.67,2.9 81.28,2.3 90.17,2.3 93.98,6.11 96.84,6.11 97.16,6.43 v97.16,6.9
  Route15 0.305: v97.16,6.9 97.16,23.26 96.52,23.89 94.3,23.89 93.5,24.68 93.5,28.18 93.03,28.65 76.52,28.65 76.2,28.97 46.99,28.97
RF_POWER_IN  (via drill 0.3 pad 0.15)  (1 unrouted)
  Top 0.305: U5.P$4 81.92,6.9 81.44,6.42 U$6.3 80.65,6.45 81.57,6.45 82.71,5.32 90.65,5.32 92.71,7.38 94.3,7.38 v95.09,8.17
  Route15 0.305: v95.09,8.17 95.09,21.19 92.08,24.21 92.08,27.22 91.76,27.54 76.36,27.54 75.88,28.02 46.99,28.02
RF_POWER_OUT  (via drill 0.3 pad 0.15)  (1 unrouted)
  Top 0.305: U4.P$4 81.41,22.75 81.12,22.46 78.74,22.46 v78.42,22.78
  Route15 0.305: v78.42,22.78 78.42,26.11 78.11,26.43 76.2,26.43 75.56,27.06 47.15,27.06
SCL  (6 unrouted)
SCLK  (2 unrouted)
SDA  (6 unrouted)
SDI  (2 unrouted)
SDO  (2 unrouted)
TR_SWITCH_CTL  (3 unrouted)
VREG1_DAC  (via drill 0.3 pad 0.15)  (2 unrouted)
  Route15 0.254: v60.33,24.37 60.01,24.68 46.83,24.68
  Bottom 0.254: R1.1 60.48,24.21 v60.33,24.37
  Bottom 0.305: R1.1 C16.1
VREG2_DAC  (2 unrouted)
  Bottom 0.152: R2.1 46.99,19.76 46.35,20.4
  Bottom 0.406: C2.1 R2.1
VSWR_BREAKER_STATE  (4 unrouted)
  Top 0.305: U$6.4 77.15,6.43 75.88,7.7 57.47,7.7 57.15,7.38